# EAGLE schematic TGBD (EAGLE 9.6.2)

## Sheet 1 of 3
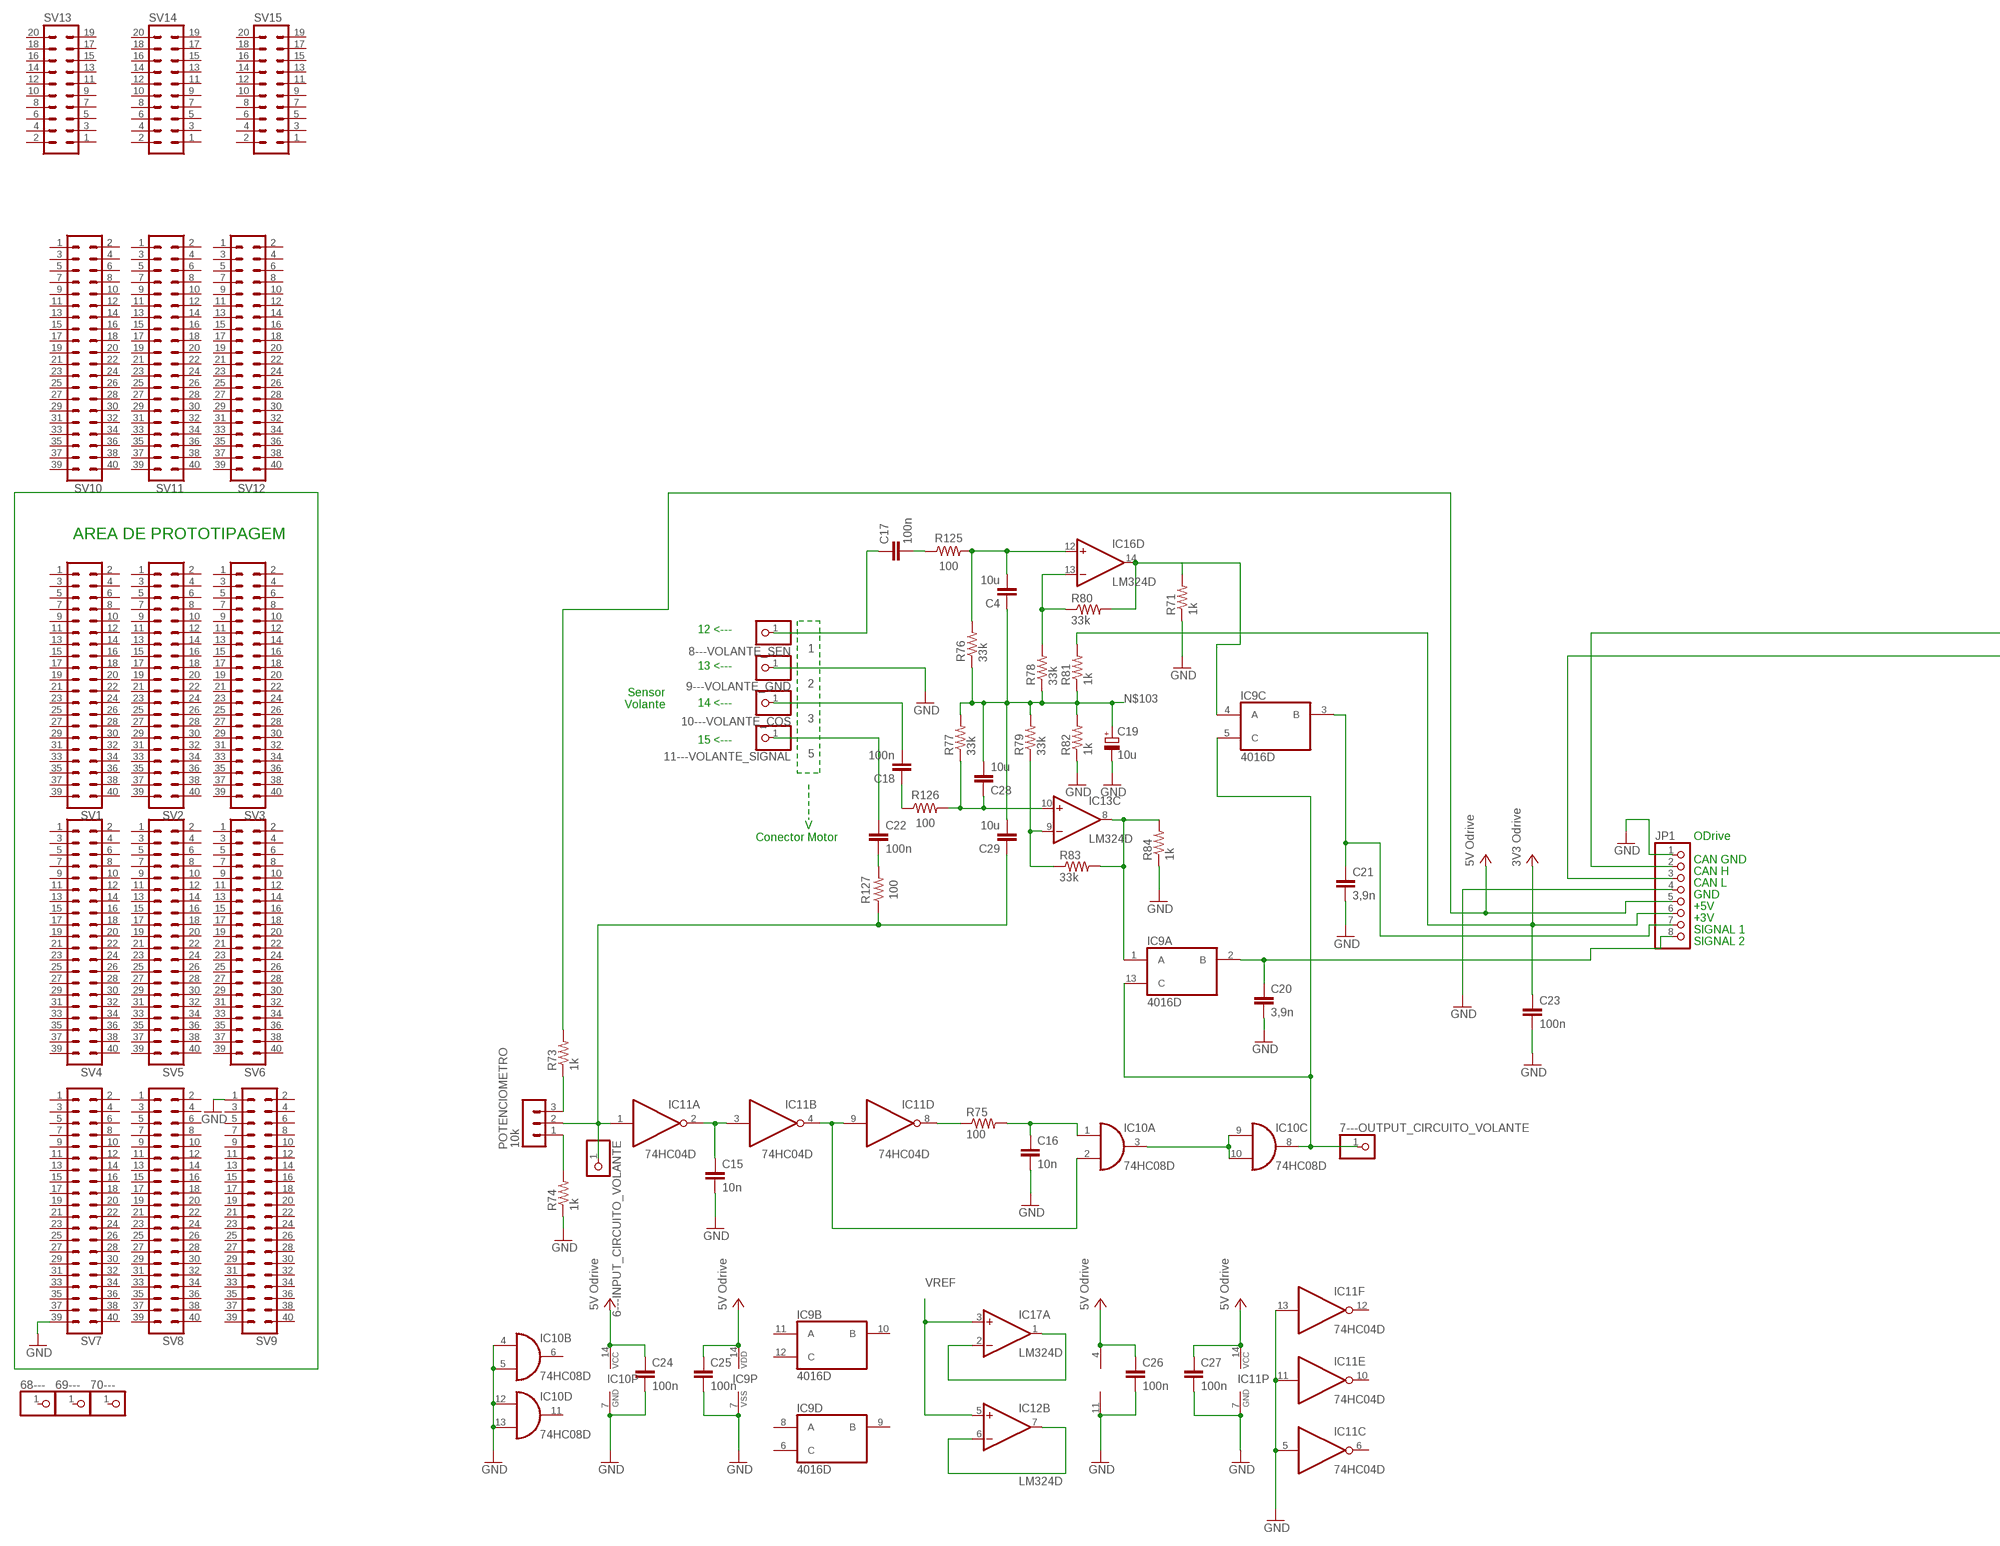
[diagram p0: schematic, sheet 1, part 1 of 2]
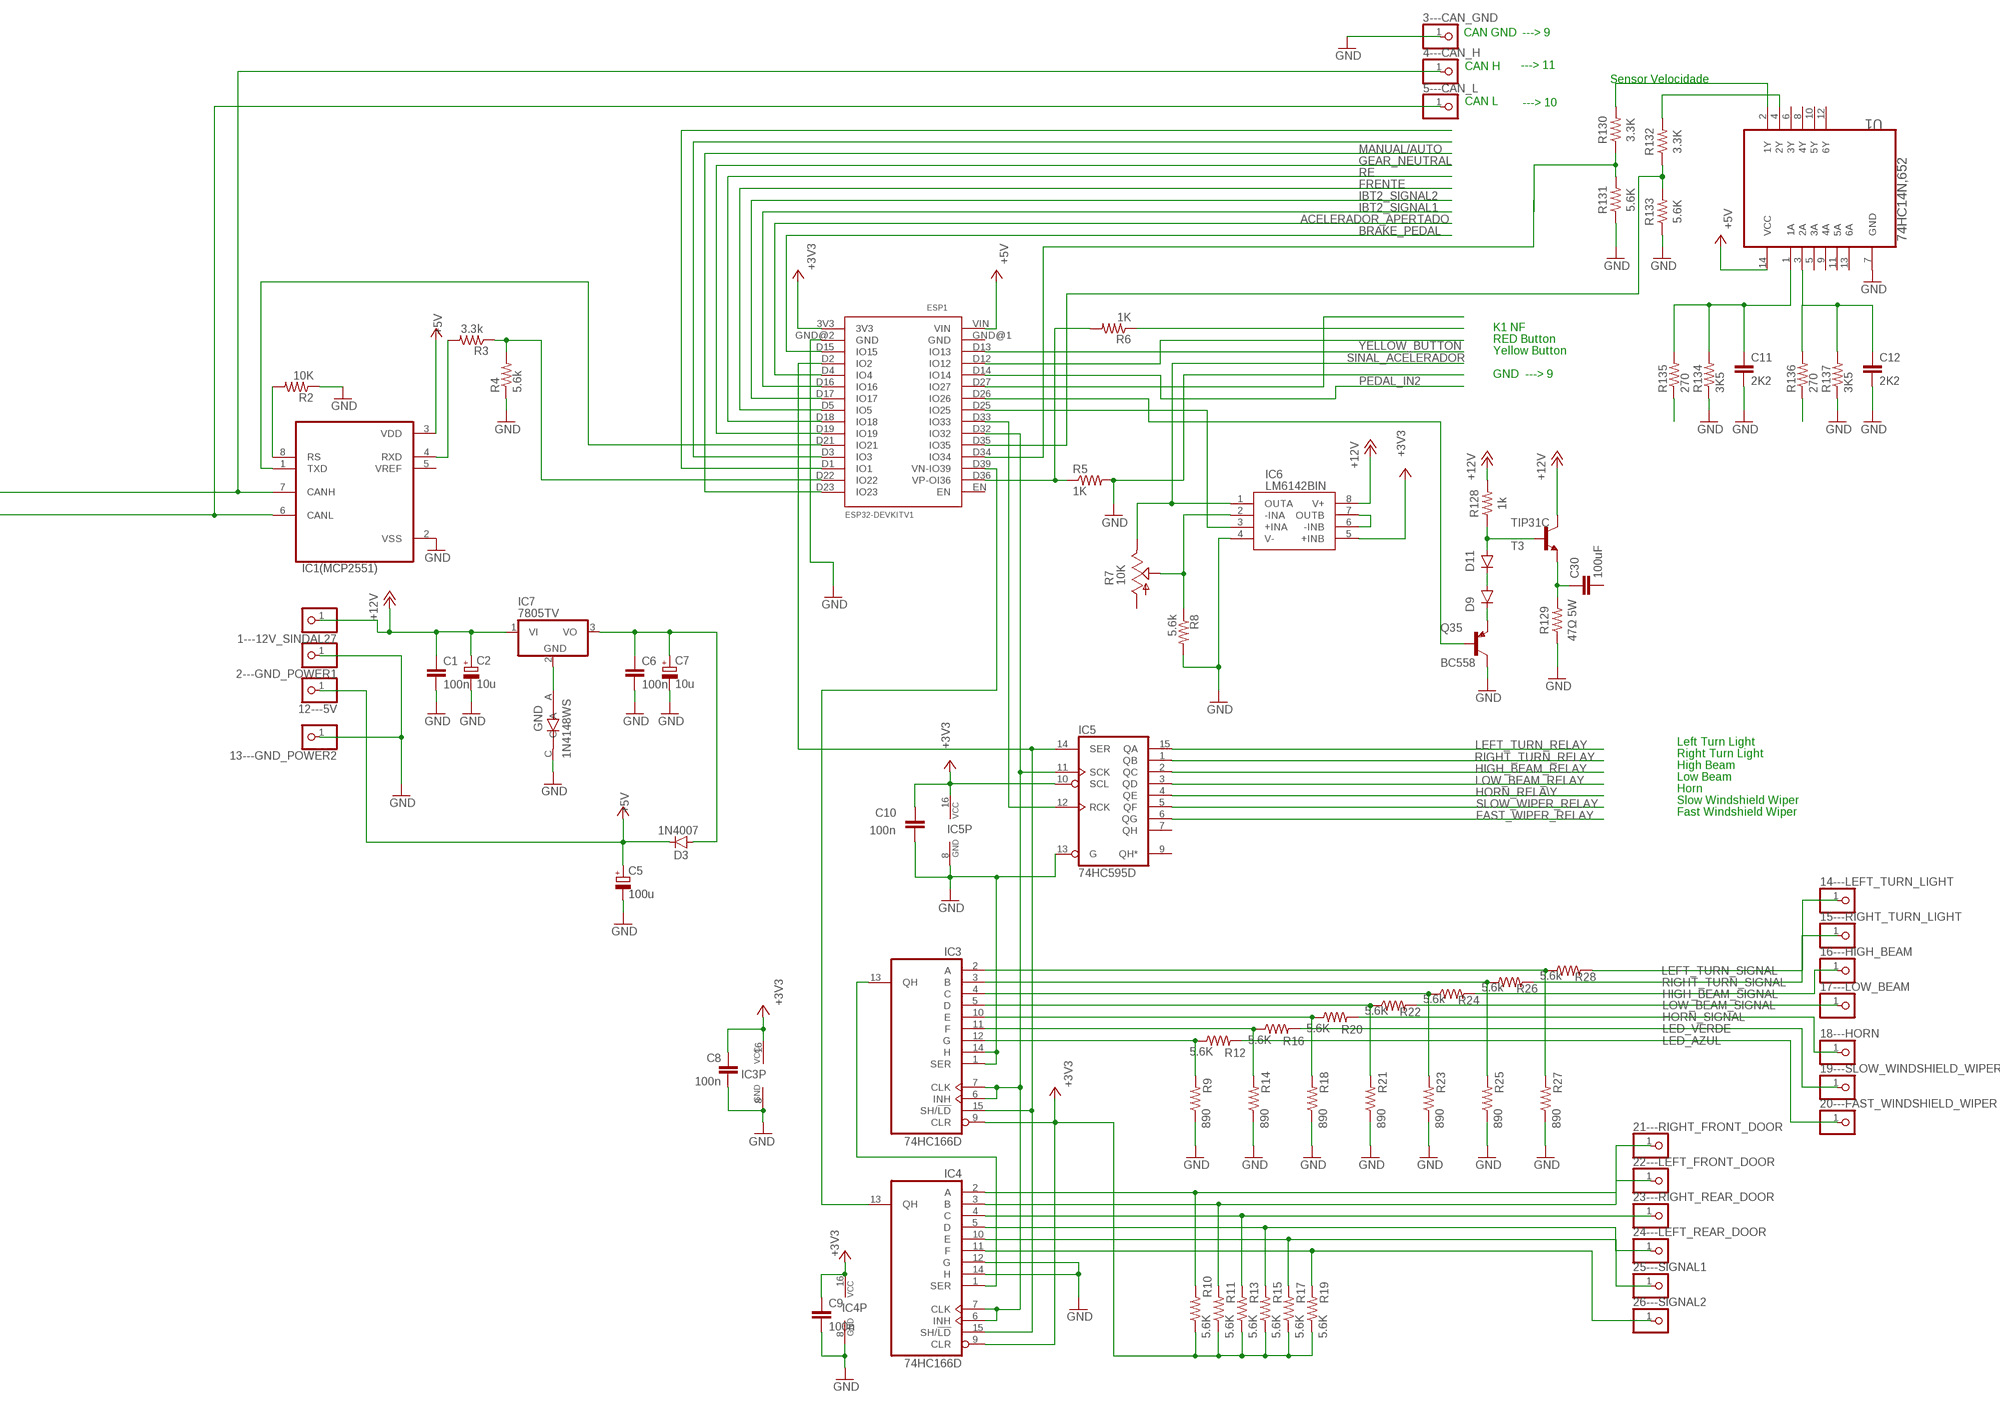
[diagram p1: schematic, sheet 1, part 2 of 2]

### Parts
1---12V_SINDAL27  PINHD-1X1  [1X01]
2---GND_POWER1  PINHD-1X1  [1X01]
3---CAN_GND  PINHD-1X1  [1X01]
4---CAN_H  PINHD-1X1  [1X01]
5---CAN_L  PINHD-1X1  [1X01]
6---INPUT_CIRCUITO_VOLANTE  PINHD-1X1  [1X01]
7---OUTPUT_CIRCUITO_VOLANTE  PINHD-1X1  [1X01]
8---VOLANTE_SEN  1  PINHD-1X1  [1X01]
9---VOLANTE_GND  2  PINHD-1X1  [1X01]
10---VOLANTE_COS  3  PINHD-1X1  [1X01]
11---VOLANTE_SIGNAL  5  PINHD-1X1  [1X01]
12---5V  PINHD-1X1  [1X01]
13---GND_POWER2  PINHD-1X1  [1X01]
14---LEFT_TURN_LIGHT  PINHD-1X1  [1X01]
15---RIGHT_TURN_LIGHT  PINHD-1X1  [1X01]
16---HIGH_BEAM  PINHD-1X1  [1X01]
17---LOW_BEAM  PINHD-1X1  [1X01]
18---HORN  PINHD-1X1  [1X01]
19---SLOW_WINDSHIELD_WIPER  PINHD-1X1  [1X01]
20---FAST_WINDSHIELD_WIPER  PINHD-1X1  [1X01]
21---RIGHT_FRONT_DOOR  PINHD-1X1  [1X01]
22---LEFT_FRONT_DOOR  PINHD-1X1  [1X01]
23---RIGHT_REAR_DOOR  PINHD-1X1  [1X01]
24---LEFT_REAR_DOOR  PINHD-1X1  [1X01]
25---SIGNAL1  PINHD-1X1  [1X01]
26---SIGNAL2  PINHD-1X1  [1X01]
68---  PINHD-1X1  [1X01]
69---  PINHD-1X1  [1X01]
70---  PINHD-1X1  [1X01]
C1  100n  C-EUC0402  [C0402]
C2  10u  CPOL-EUA/3216-18R  [A/3216-18R]
C4  10u  C-EUC0402  [C0402]
C5  100u  CPOL-EUUD-6,3X7,7  [UD-6,3X7,7_NICHICON]
C6  100n  C-EUC0402  [C0402]
C7  10u  CPOL-EUA/3216-18R  [A/3216-18R]
C8  100n  C-EUC0402  [C0402]
C9  100n  C-EUC0402  [C0402]
C10  100n  C-EUC0402  [C0402]
C11  2K2  C2,5-3  [C2.5-3]
C12  2K2  C2,5-3  [C2.5-3]
C15  10n  C-EUC0402  [C0402]
C16  10n  C-EUC0402  [C0402]
C17  100n  C-EUC0402  [C0402]
C18  100n  C-EUC0402  [C0402]
C19  10u  CPOL-EUA/3216-18R  [A/3216-18R]
C20  3,9n  C-EUC0402  [C0402]
C21  3,9n  C-EUC0402  [C0402]
C22  100n  C-EUC0402  [C0402]
C23  100n  C-EUC0402  [C0402]
C24  100n  C-EUC0402  [C0402]
C25  100n  C-EUC0402  [C0402]
C26  100n  C-EUC0402  [C0402]
C27  100n  C-EUC0402  [C0402]
C28  10u  C-EUC0402  [C0402]
C29  10u  C-EUC0402  [C0402]
C30  100uF  C2.5/2  [C2.5-2]
D3  1N4007  DIODE-SOD123  [SOD123]
D9  1N4148DO35-7  [DO35-7]
D11  1N4148DO35-7  [DO35-7]
ESP1  ESP32DEVKITV1  [ESP32-DEVKITV1]
GND  1N4148WS  [SODFL2512X100N]
IC1(MCP2551)  MCP2551-I/SN  [SOIC127P599X175-8N]
IC3  74HC166D  [SO16]
IC4  74HC166D  [SO16]
IC5  74HC595D  [SO16]
IC6  LM6142BIN  [DIP254P762X508-8]
IC7  7805TV  [TO220V]
IC8  LM324D  [SO14]
IC9  4016D  [SO14]
IC10  74HC08D  [SO14]
IC11  74HC04D  [SO14]
IC12  LM324D  [SO14]
IC13  LM324D  [SO14]
IC16  LM324D  [SO14]
IC17  LM324D  [SO14]
JP1  PINHD-1X8  [1X08]
POTENCIOMETRO  10k  MA03-1  [MA03-1]
Q35  BC558  [TO92260P520H933-3]
R2  10K  R-US_R0603  [R0603]
R3  3.3k  R-US_R0402  [R0402]
R4  5.6k  R-US_R0603  [R0603]
R5  1K  R-US_R0402  [R0402]
R6  1K  R-US_R0402  [R0402]
R7  10K  TRIM_US-CT6  [CT6]
R8  5.6k  R-US_R0603  [R0603]
R9  890  R-US_R0603  [R0603]
R10  5.6K  R-US_R0603  [R0603]
R11  5.6K  R-US_R0603  [R0603]
R12  5.6K  R-US_R0603  [R0603]
R13  5.6K  R-US_R0603  [R0603]
R14  890  R-US_R0603  [R0603]
R15  5.6K  R-US_R0603  [R0603]
R16  5.6K  R-US_R0603  [R0603]
R17  5.6K  R-US_R0603  [R0603]
R18  890  R-US_R0603  [R0603]
R19  5.6K  R-US_R0603  [R0603]
R20  5.6K  R-US_R0603  [R0603]
R21  890  R-US_R0603  [R0603]
R22  5.6K  R-US_R0603  [R0603]
R23  890  R-US_R0603  [R0603]
R24  5.6k  R-US_R0603  [R0603]
R25  890  R-US_R0603  [R0603]
R26  5.6k  R-US_R0603  [R0603]
R27  890  R-US_R0603  [R0603]
R28  5.6k  R-US_R0603  [R0603]
R71  1k  R-US_R0402  [R0402]
R73  1k  R-US_R0402  [R0402]
R74  1k  R-US_R0402  [R0402]
R75  100  R-US_R0603  [R0603]
R76  33k  R-US_R0402  [R0402]
R77  33k  R-US_R0402  [R0402]
R78  33k  R-US_R0402  [R0402]
R79  33k  R-US_R0402  [R0402]
R80  33k  R-US_R0402  [R0402]
R81  1k  R-US_R0402  [R0402]
R82  1k  R-US_R0402  [R0402]
R83  33k  R-US_R0402  [R0402]
R84  1k  R-US_R0402  [R0402]
R125  100  R-US_CHIP-0402(1005-METRIC)  [RESC1005X40]
R126  100  R-US_CHIP-0402(1005-METRIC)  [RESC1005X40]
R127  100  R-US_CHIP-0402(1005-METRIC)  [RESC1005X40]
R128  1k  R-US_AXIAL-7.2MM-PITCH  [RESAD724W46L381D178B]
R129  47Ω 5W  R-US_AXIAL-7.2MM-PITCH  [RESAD724W46L381D178B]
R130  3.3K  R-US_AXIAL-7.2MM-PITCH  [RESAD724W46L381D178B]
R131  5.6K  R-US_AXIAL-7.2MM-PITCH  [RESAD724W46L381D178B]
R132  3.3K  R-US_AXIAL-7.2MM-PITCH  [RESAD724W46L381D178B]
R133  5.6K  R-US_AXIAL-7.2MM-PITCH  [RESAD724W46L381D178B]
R134  3K5  R-US_0204/7  [0204/7]
R135  270  R-US_0204/7  [0204/7]
R136  270  R-US_0204/7  [0204/7]
R137  3K5  R-US_0204/7  [0204/7]
SV1  MA20-2  [MA20-2]
SV2  MA20-2  [MA20-2]
SV3  MA20-2  [MA20-2]
SV4  MA20-2  [MA20-2]
SV5  MA20-2  [MA20-2]
SV6  MA20-2  [MA20-2]
SV7  MA20-2  [MA20-2]
SV8  MA20-2  [MA20-2]
SV9  MA20-2  [MA20-2]
SV10  MA20-2  [MA20-2]
SV11  MA20-2  [MA20-2]
SV12  MA20-2  [MA20-2]
SV13  MA10-2  [MA10-2]
SV14  MA10-2  [MA10-2]
SV15  MA10-2  [MA10-2]
T3  TIP31C  [TO220]
U1  74HC14N,652  [DIP254P762X420-14]

### Nets
3V3_ODRIVE [Power]: C23.1 JP1.6 R81.2 ; supply symbol labelled 3V3 Odrive
5V_ODRIVE [Power]: C24.1 C25.1 C26.1 C27.1 IC8.4(P:V+) IC9.14(P:VDD) IC10.14(P:VCC) IC11.14(P:VCC) JP1.5 R73.2 ; supply symbol labelled 5V Odrive
9---GND [Power]: 9---VOLANTE_GND.1 ; supply symbol labelled GND
+3V3 [Power]: C8.1 C9.1 C10.1 ESP1.3V3 IC3.9(CLR) IC3.16(VCC) IC4.9(CLR) IC4.16(VCC) IC5.10(SCL) IC5.16(VCC) IC6.5(+INB) R10.1 R11.1 R13.1 R15.1 R17.1 R19.1
+5V [Power]: 12---5V.1 C5.+ D3.C ESP1.VIN IC1(MCP2551).3(VDD) U1.14(VCC) ; also sheet 2
+12V [Power]: 1---12V_SINDAL27.1 C1.1 C2.+ IC6.8(V+) IC7.1(VI) R128.2 T3.2(C) ; also sheet 2
ACELERADOR_APERTADO: ESP1.D4(IO4) ; also sheet 2
AUTONOMO/NAO: ESP1.D27(IO27)
BRAKE_PEDAL: ESP1.D15(IO15)
FAST_WIPER_RELAY: IC5.6(QG) ; also sheet 2
FRENTE: ESP1.D5(IO5) ; also sheet 2
GEAR_NEUTRAL: ESP1.D19(IO19)
GND [Power]: 2---GND_POWER1.1 3---CAN_GND.1 13---GND_POWER2.1 C1.2 C2.- C5.- C6.2 C7.- C8.2 C9.2 C10.2 C11.2 C12.2 C15.2 C16.2 C19.- C20.2 C21.2 C23.2 C24.2 C25.2 C26.2 C27.2 ESP1.GND@2(GND) GND.C IC1(MCP2551).2(VSS) IC3.1(SER) IC3.8(GND) IC3.14(H) IC4.8(GND) IC4.12(G) IC4.14(H) IC5.8(GND) IC5.13(G) IC6.4(V-) IC8.11(P:V-) IC9.7(P:VSS) IC10.4(B:I0) IC10.5(B:I1) IC10.7(P:GND) IC10.12(D:I0) IC10.13(D:I1) IC11.5(C:I) IC11.7(P:GND) IC11.11(E:I) IC11.13(F:I) JP1.1 JP1.4 Q35.1(C) R2.1 R4.1 R5.2 R8.2 R9.1 R14.1 R18.1 R21.1 R23.1 R25.1 R27.1 R71.1 R74.1 R82.1 R84.1 R129.1 R131.1 R133.1 R134.1 R137.1 SV7.39 SV9.1 U1.7(GND) ; also sheet 2
HIGH_BEAM_RELAY: IC5.2(QC) ; also sheet 2
HIGH_BEAM_SIGNAL: 16---HIGH_BEAM.1 R24.2 ; also sheet 2
HORN_RELA\Y: IC5.4(QE)
HORN_SIGNAL: 18---HORN.1 R20.2 ; also sheet 2
IBT2_SIGNAL1: ESP1.D16(IO16)
IBT2_SIGNAL2: ESP1.D17(IO17)
LED_AZUL: 20---FAST_WINDSHIELD_WIPER.1 R12.2 ; also sheet 2
LED_VERDE: 19---SLOW_WINDSHIELD_WIPER.1 R16.2 ; also sheet 2
LEFT_TURN_RELAY: IC5.15(QA) ; also sheet 2
LEFT_TURN_SIGNAL: 14---LEFT_TURN_LIGHT.1 R28.2 ; also sheet 2
LOW_BEAM_RELAY: IC5.3(QD) ; also sheet 2
LOW_BEAM_SIGNAL: 17---LOW_BEAM.1 R22.2 ; also sheet 2
MANUAL/AUTO: ESP1.D23(IO23) ; also sheet 2
N$1: IC6.6(-INB) IC6.7(OUTB)
N$2: ESP1.D25(IO25) IC6.3(+INA)
N$3: IC6.2(-INA) R7.S R8.1
N$6: ESP1.D21(IO21) IC1(MCP2551).1(TXD)
N$8: IC1(MCP2551).8(RS) R2.2
N$10: IC1(MCP2551).4(RXD) R3.2
N$11: 4---CAN_H.1 IC1(MCP2551).7(CANH) JP1.2
N$12: GND.A IC7.2(GND)
N$14: ESP1.D32(IO32) IC3.6(INH) IC3.7(CLK) IC4.6(INH) IC4.7(CLK) IC5.11(SCK)
N$15: ESP1.D22(IO22) R3.1 R4.2
N$18 [Power]: C6.1 C7.+ D3.A IC7.3(VO)
N$21: POTENCIOMETRO.3 R73.1
N$27: ESP1.D36(VP-OI36) R5.1 R6.2
N$28: D9.C Q35.3(E)
N$29: R6.1
N$30: ESP1.D12(IO12)
N$32: IC3.2(A) R27.2 R28.1
N$40: ESP1.D33(IO33) IC5.12(RCK)
N$42: IC3.3(B) R25.2 R26.1
N$44: IC3.4(C) R23.2 R24.1
N$46: IC3.5(D) R21.2 R22.1
N$47: ESP1.D39(VN-IO39) IC4.13(QH)
N$48: 21---RIGHT_FRONT_DOOR.1 IC4.2(A) R10.2
N$49: 22---LEFT_FRONT_DOOR.1 IC4.3(B) R11.2
N$50: 23---RIGHT_REAR_DOOR.1 IC4.4(C) R13.2
N$51: 24---LEFT_REAR_DOOR.1 IC4.5(D) R15.2
N$52: IC3.13(QH) IC4.1(SER)
N$54: IC3.10(E) R18.2 R20.1
N$56: IC3.11(F) R14.2 R16.1
N$58: IC3.12(G) R9.2 R12.1
N$59: ESP1.D3(IO3)
N$99: C15.1 IC11.2(A:O) IC11.3(B:I)
N$100: IC10.3(A:O) IC10.9(C:I0) IC10.10(C:I1)
N$101: 5---CAN_L.1 IC1(MCP2551).6(CANL) JP1.3
N$102: POTENCIOMETRO.1 R74.2
N$103: C4.1 C19.+ C28.2 C29.2 R76.1 R77.2 R78.1 R79.2 R81.1 R82.2
N$104: IC11.8(D:O) R75.1
N$105: C16.1 IC10.1(A:I0) R75.2
N$106: IC10.2(A:I1) IC11.4(B:O) IC11.9(D:I)
N$107: C4.2 IC16.12(D:+IN) R76.2 R125.2
N$108: 8---VOLANTE_SEN.1 C17.1
N$109: C11.1 R134.2 R135.2 U1.1(1A)
N$110: IC13.9(C:-IN) R79.1 R83.1
N$111: IC16.13(D:-IN) R78.2 R80.1
N$112: 10---VOLANTE_COS.1 C18.2
N$113: IC9.1(A:A) IC13.8(C:OUT) R83.2 R84.2
N$114: C20.1 IC9.2(A:B) JP1.8
N$115: IC17.1(A:OUT) IC17.2(A:-IN)
N$116: IC12.6(B:-IN) IC12.7(B:OUT)
N$117: 7---OUTPUT_CIRCUITO_VOLANTE.1 IC9.5(C:C) IC9.13(A:C) IC10.8(C:O)
N$118: C21.1 IC9.3(C:B) JP1.7
N$119: 11---VOLANTE_SIGNAL.1 C22.1
N$120: C28.1 IC13.10(C:+IN) R77.1 R126.2
N$182: IC9.4(C:A) IC16.14(D:OUT) R71.2 R80.2
N$187: ESP1.D1(IO1)
N$191: 25---SIGNAL1.1 IC4.10(E) R17.2
N$192: 26---SIGNAL2.1 IC4.11(F) R19.2
N$205: R135.1
N$216: C17.2 R125.1
N$218: C18.1 R126.1
N$219: C22.2 R127.2
N$222: ESP1.D2(IO2) IC3.15(SH/!LD) IC4.15(SH/!LD) IC5.14(SER)
N$223: ESP1.D26(IO26) Q35.2(B)
N$224: D9.A D11.C
N$225: D11.A R128.1 T3.1(B)
N$226: R130.1 R131.2
N$227: R130.2 U1.2(1Y)
N$228: C30.1 R129.2 T3.3(E)
N$229: C12.1 R136.2 R137.2 U1.3(2A)
N$230: R132.2 U1.4(2Y)
N$231: R136.1
N$232: ESP1.D35(IO35) R132.1 R133.2
PEDAL_IN1: ESP1.D34(IO34)
PEDAL_IN2: ESP1.D14(IO14)
RE: ESP1.D18(IO18) ; also sheet 2
RIGHT_TURN_RELAY: IC5.1(QB) ; also sheet 2
RIGHT_TURN_SIGNAL: 15---RIGHT_TURN_LIGHT.1 R26.2 ; also sheet 2
SINAL_ACELERADOR: IC6.1(OUTA) R7.E ; also sheet 2
SLOW_WIPER_RELAY: IC5.5(QF) ; also sheet 2
VREF: 6---INPUT_CIRCUITO_VOLANTE.1 C29.1 IC11.1(A:I) IC12.5(B:+IN) IC17.3(A:+IN) POTENCIOMETRO.2 R127.1
YELLOW_BUTTON: ESP1.D13(IO13) ; also sheet 2
Unconnected: 68---.1 69---.1 70---.1 C30.2 ESP1.EN ESP1.GND@1(GND) IC1(MCP2551).5(VREF) IC5.7(QH) IC5.9(QH*) IC8.1(A:OUT) IC8.2(A:-IN) IC8.3(A:+IN) IC8.5(B:+IN) IC8.6(B:-IN) IC8.7(B:OUT) IC8.8(C:OUT) IC8.9(C:-IN) IC8.10(C:+IN) IC8.12(D:+IN) IC8.13(D:-IN) IC8.14(D:OUT) IC9.6(D:C) IC9.8(D:A) IC9.9(D:B) IC9.10(B:B) IC9.11(B:A) IC9.12(B:C) IC10.6(B:O) IC10.11(D:O) IC11.6(C:O) IC11.10(E:O) IC11.12(F:O) IC12.1(A:OUT) IC12.2(A:-IN) IC12.3(A:+IN) IC12.8(C:OUT) IC12.9(C:-IN) IC12.10(C:+IN) IC12.12(D:+IN) IC12.13(D:-IN) IC12.14(D:OUT) IC13.1(A:OUT) IC13.2(A:-IN) IC13.3(A:+IN) IC13.5(B:+IN) IC13.6(B:-IN) IC13.7(B:OUT) IC13.12(D:+IN) IC13.13(D:-IN) IC13.14(D:OUT) IC16.1(A:OUT) IC16.2(A:-IN) IC16.3(A:+IN) IC16.5(B:+IN) IC16.6(B:-IN) IC16.7(B:OUT) IC16.8(C:OUT) IC16.9(C:-IN) IC16.10(C:+IN) IC17.5(B:+IN) IC17.6(B:-IN) IC17.7(B:OUT) IC17.8(C:OUT) IC17.9(C:-IN) IC17.10(C:+IN) IC17.12(D:+IN) IC17.13(D:-IN) IC17.14(D:OUT) R7.A SV1.1 SV1.2 SV1.3 SV1.4 SV1.5 SV1.6 SV1.7 SV1.8 SV1.9 SV1.10 SV1.11 SV1.12 SV1.13 SV1.14 SV1.15 SV1.16 SV1.17 SV1.18 SV1.19 SV1.20 SV1.21 SV1.22 SV1.23 SV1.24 SV1.25 SV1.26 SV1.27 SV1.28 SV1.29 SV1.30 SV1.31 SV1.32 SV1.33 SV1.34 SV1.35 SV1.36 SV1.37 SV1.38 SV1.39 SV1.40 SV2.1 SV2.2 SV2.3 SV2.4 SV2.5 SV2.6 SV2.7 SV2.8 SV2.9 SV2.10 SV2.11 SV2.12 SV2.13 SV2.14 SV2.15 SV2.16 SV2.17 SV2.18 SV2.19 SV2.20 SV2.21 SV2.22 SV2.23 SV2.24 SV2.25 SV2.26 SV2.27 SV2.28 SV2.29 SV2.30 SV2.31 SV2.32 SV2.33 SV2.34 SV2.35 SV2.36 SV2.37 SV2.38 SV2.39 SV2.40 SV3.1 SV3.2 SV3.3 SV3.4 SV3.5 SV3.6 SV3.7 SV3.8 SV3.9 SV3.10 SV3.11 SV3.12 SV3.13 SV3.14 SV3.15 SV3.16 SV3.17 SV3.18 SV3.19 SV3.20 SV3.21 SV3.22 SV3.23 SV3.24 SV3.25 SV3.26 SV3.27 SV3.28 SV3.29 SV3.30 SV3.31 SV3.32 SV3.33 SV3.34 SV3.35 SV3.36 SV3.37 SV3.38 SV3.39 SV3.40 SV4.1 SV4.2 SV4.3 SV4.4 SV4.5 SV4.6 SV4.7 SV4.8 SV4.9 SV4.10 SV4.11 SV4.12 SV4.13 SV4.14 SV4.15 SV4.16 SV4.17 SV4.18 SV4.19 SV4.20 SV4.21 SV4.22 SV4.23 SV4.24 SV4.25 SV4.26 SV4.27 SV4.28 SV4.29 SV4.30 SV4.31 SV4.32 SV4.33 SV4.34 SV4.35 SV4.36 SV4.37 SV4.38 SV4.39 SV4.40 SV5.1 SV5.2 SV5.3 SV5.4 SV5.5 SV5.6 SV5.7 SV5.8 SV5.9 SV5.10 SV5.11 SV5.12 SV5.13 SV5.14 SV5.15 SV5.16 SV5.17 SV5.18 SV5.19 SV5.20 SV5.21 SV5.22 SV5.23 SV5.24 SV5.25 SV5.26 SV5.27 SV5.28 SV5.29 SV5.30 SV5.31 SV5.32 SV5.33 SV5.34 SV5.35 SV5.36 SV5.37 SV5.38 SV5.39 SV5.40 SV6.1 SV6.2 SV6.3 SV6.4 SV6.5 SV6.6 SV6.7 SV6.8 SV6.9 SV6.10 SV6.11 SV6.12 SV6.13 SV6.14 SV6.15 SV6.16 SV6.17 SV6.18 SV6.19 SV6.20 SV6.21 SV6.22 SV6.23 SV6.24 SV6.25 SV6.26 SV6.27 SV6.28 SV6.29 SV6.30 SV6.31 SV6.32 SV6.33 SV6.34 SV6.35 SV6.36 SV6.37 SV6.38 SV6.39 SV6.40 SV7.1 SV7.2 SV7.3 SV7.4 SV7.5 SV7.6 SV7.7 SV7.8 SV7.9 SV7.10 SV7.11 SV7.12 SV7.13 SV7.14 SV7.15 SV7.16 SV7.17 SV7.18 SV7.19 SV7.20 SV7.21 SV7.22 SV7.23 SV7.24 SV7.25 SV7.26 SV7.27 SV7.28 SV7.29 SV7.30 SV7.31 SV7.32 SV7.33 SV7.34 SV7.35 SV7.36 SV7.37 SV7.38 SV7.40 SV8.1 SV8.2 SV8.3 SV8.4 SV8.5 SV8.6 SV8.7 SV8.8 SV8.9 SV8.10 SV8.11 SV8.12 SV8.13 SV8.14 SV8.15 SV8.16 SV8.17 SV8.18 SV8.19 SV8.20 SV8.21 SV8.22 SV8.23 SV8.24 SV8.25 SV8.26 SV8.27 SV8.28 SV8.29 SV8.30 SV8.31 SV8.32 SV8.33 SV8.34 SV8.35 SV8.36 SV8.37 SV8.38 SV8.39 SV8.40 SV9.2 SV9.3 SV9.4 SV9.5 SV9.6 SV9.7 SV9.8 SV9.9 SV9.10 SV9.11 SV9.12 SV9.13 SV9.14 SV9.15 SV9.16 SV9.17 SV9.18 SV9.19 SV9.20 SV9.21 SV9.22 SV9.23 SV9.24 SV9.25 SV9.26 SV9.27 SV9.28 SV9.29 SV9.30 SV9.31 SV9.32 SV9.33 SV9.34 SV9.35 SV9.36 SV9.37 SV9.38 SV9.39 SV9.40 SV10.1 SV10.2 SV10.3 SV10.4 SV10.5 SV10.6 SV10.7 SV10.8 SV10.9 SV10.10 SV10.11 SV10.12 SV10.13 SV10.14 SV10.15 SV10.16 SV10.17 SV10.18 SV10.19 SV10.20 SV10.21 SV10.22 SV10.23 SV10.24 SV10.25 SV10.26 SV10.27 SV10.28 SV10.29 SV10.30 SV10.31 SV10.32 SV10.33 SV10.34 SV10.35 SV10.36 SV10.37 SV10.38 SV10.39 SV10.40 SV11.1 SV11.2 SV11.3 SV11.4 SV11.5 SV11.6 SV11.7 SV11.8 SV11.9 SV11.10 SV11.11 SV11.12 SV11.13 SV11.14 SV11.15 SV11.16 SV11.17 SV11.18 SV11.19 SV11.20 SV11.21 SV11.22 SV11.23 SV11.24 SV11.25 SV11.26 SV11.27 SV11.28 SV11.29 SV11.30 SV11.31 SV11.32 SV11.33 SV11.34 SV11.35 SV11.36 SV11.37 SV11.38 SV11.39 SV11.40 SV12.1 SV12.2 SV12.3 SV12.4 SV12.5 SV12.6 SV12.7 SV12.8 SV12.9 SV12.10 SV12.11 SV12.12 SV12.13 SV12.14 SV12.15 SV12.16 SV12.17 SV12.18 SV12.19 SV12.20 SV12.21 SV12.22 SV12.23 SV12.24 SV12.25 SV12.26 SV12.27 SV12.28 SV12.29 SV12.30 SV12.31 SV12.32 SV12.33 SV12.34 SV12.35 SV12.36 SV12.37 SV12.38 SV12.39 SV12.40 SV13.1 SV13.2 SV13.3 SV13.4 SV13.5 SV13.6 SV13.7 SV13.8 SV13.9 SV13.10 SV13.11 SV13.12 SV13.13 SV13.14 SV13.15 SV13.16 SV13.17 SV13.18 SV13.19 SV13.20 SV14.1 SV14.2 SV14.3 SV14.4 SV14.5 SV14.6 SV14.7 SV14.8 SV14.9 SV14.10 SV14.11 SV14.12 SV14.13 SV14.14 SV14.15 SV14.16 SV14.17 SV14.18 SV14.19 SV14.20 SV15.1 SV15.2 SV15.3 SV15.4 SV15.5 SV15.6 SV15.7 SV15.8 SV15.9 SV15.10 SV15.11 SV15.12 SV15.13 SV15.14 SV15.15 SV15.16 SV15.17 SV15.18 SV15.19 SV15.20 U1.5(3A) U1.6(3Y) U1.8(4Y) U1.9(4A) U1.10(5Y) U1.11(5A) U1.12(6Y) U1.13(6A)

### Notes on the sheet
- CAN GND | ---> 9
- CAN H
- Sensor Velocidade
- ---> 11
- CAN L | ---> 10
- K1 NF
- RED Button
- Yellow Button
- GND | ---> 9
- AREA DE PROTOTIPAGEM
- Sensor
  Volante
- 12 <---
  
  
  13 <---
  
  
  14 <---
  
  
  15 <---
- V
  Conector Motor
- ODrive
- CAN GND
- CAN H
- CAN L | Left Turn Light
- GND | Right Turn Light
- +5V | High Beam
- +3V | Low Beam
- SIGNAL 1 | Horn
- SIGNAL 2 | Slow Windshield Wiper
- Fast Windshield Wiper

## Sheet 2 of 3
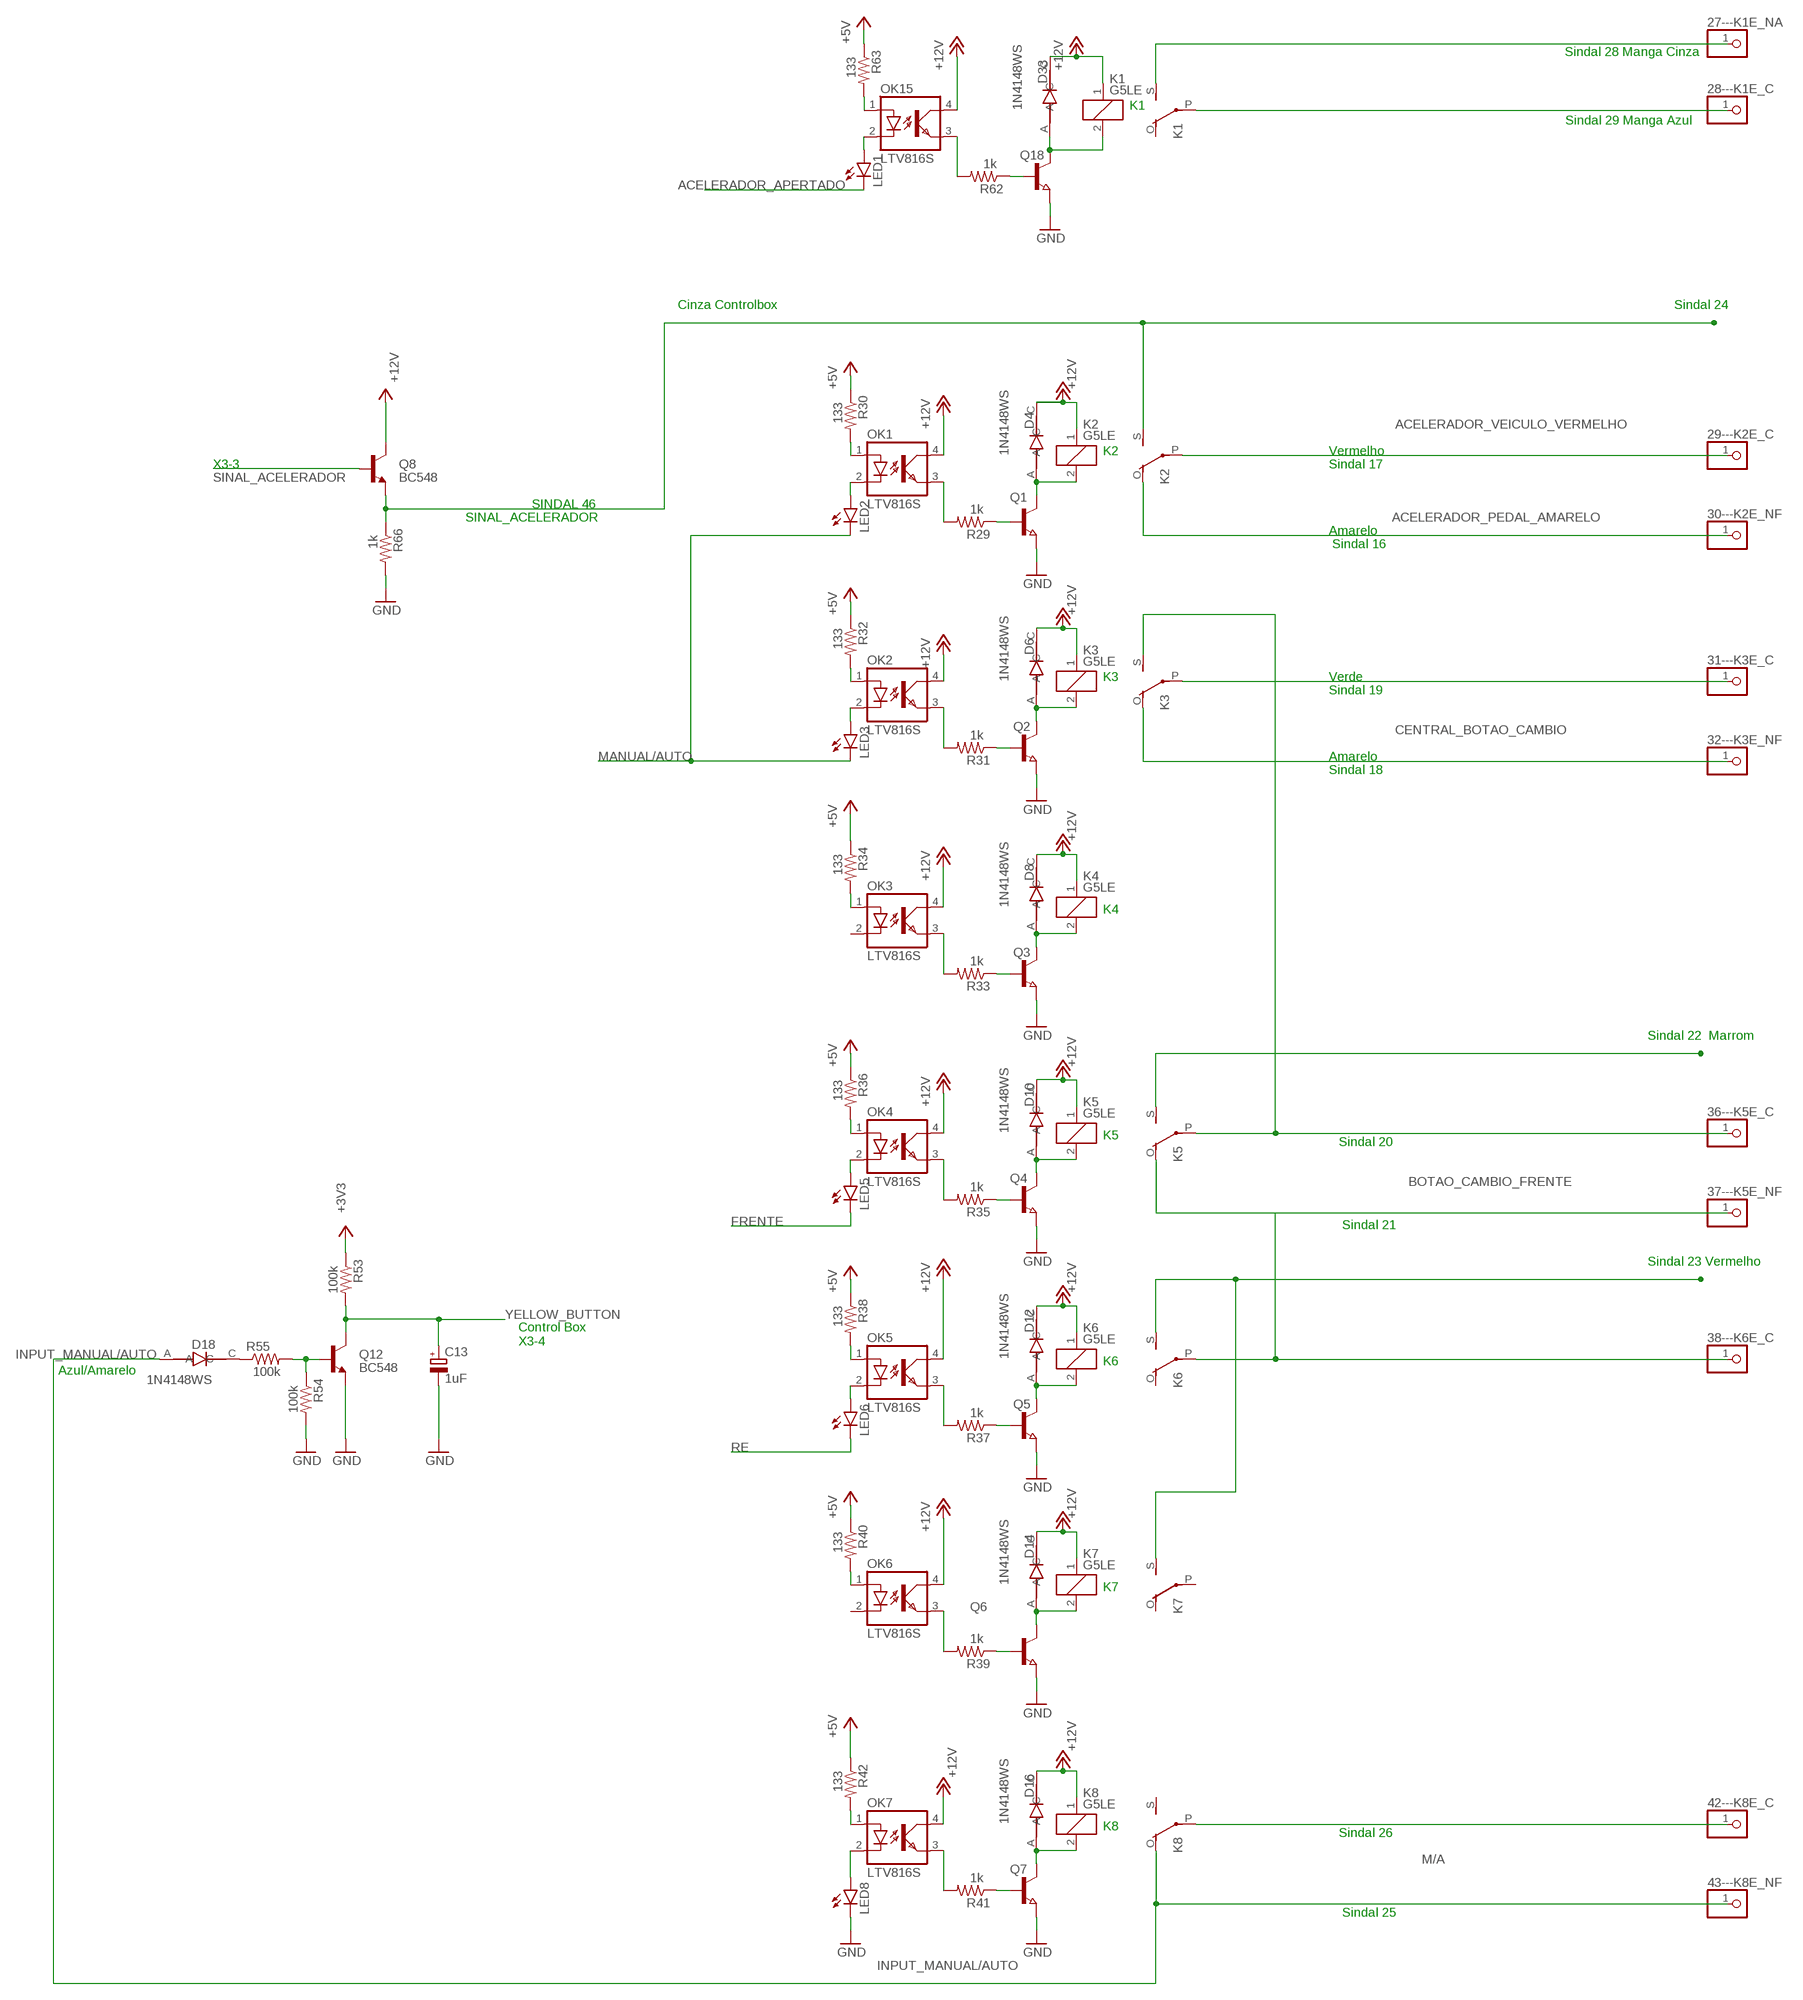
[diagram p2: schematic, sheet 2, part 1 of 2]
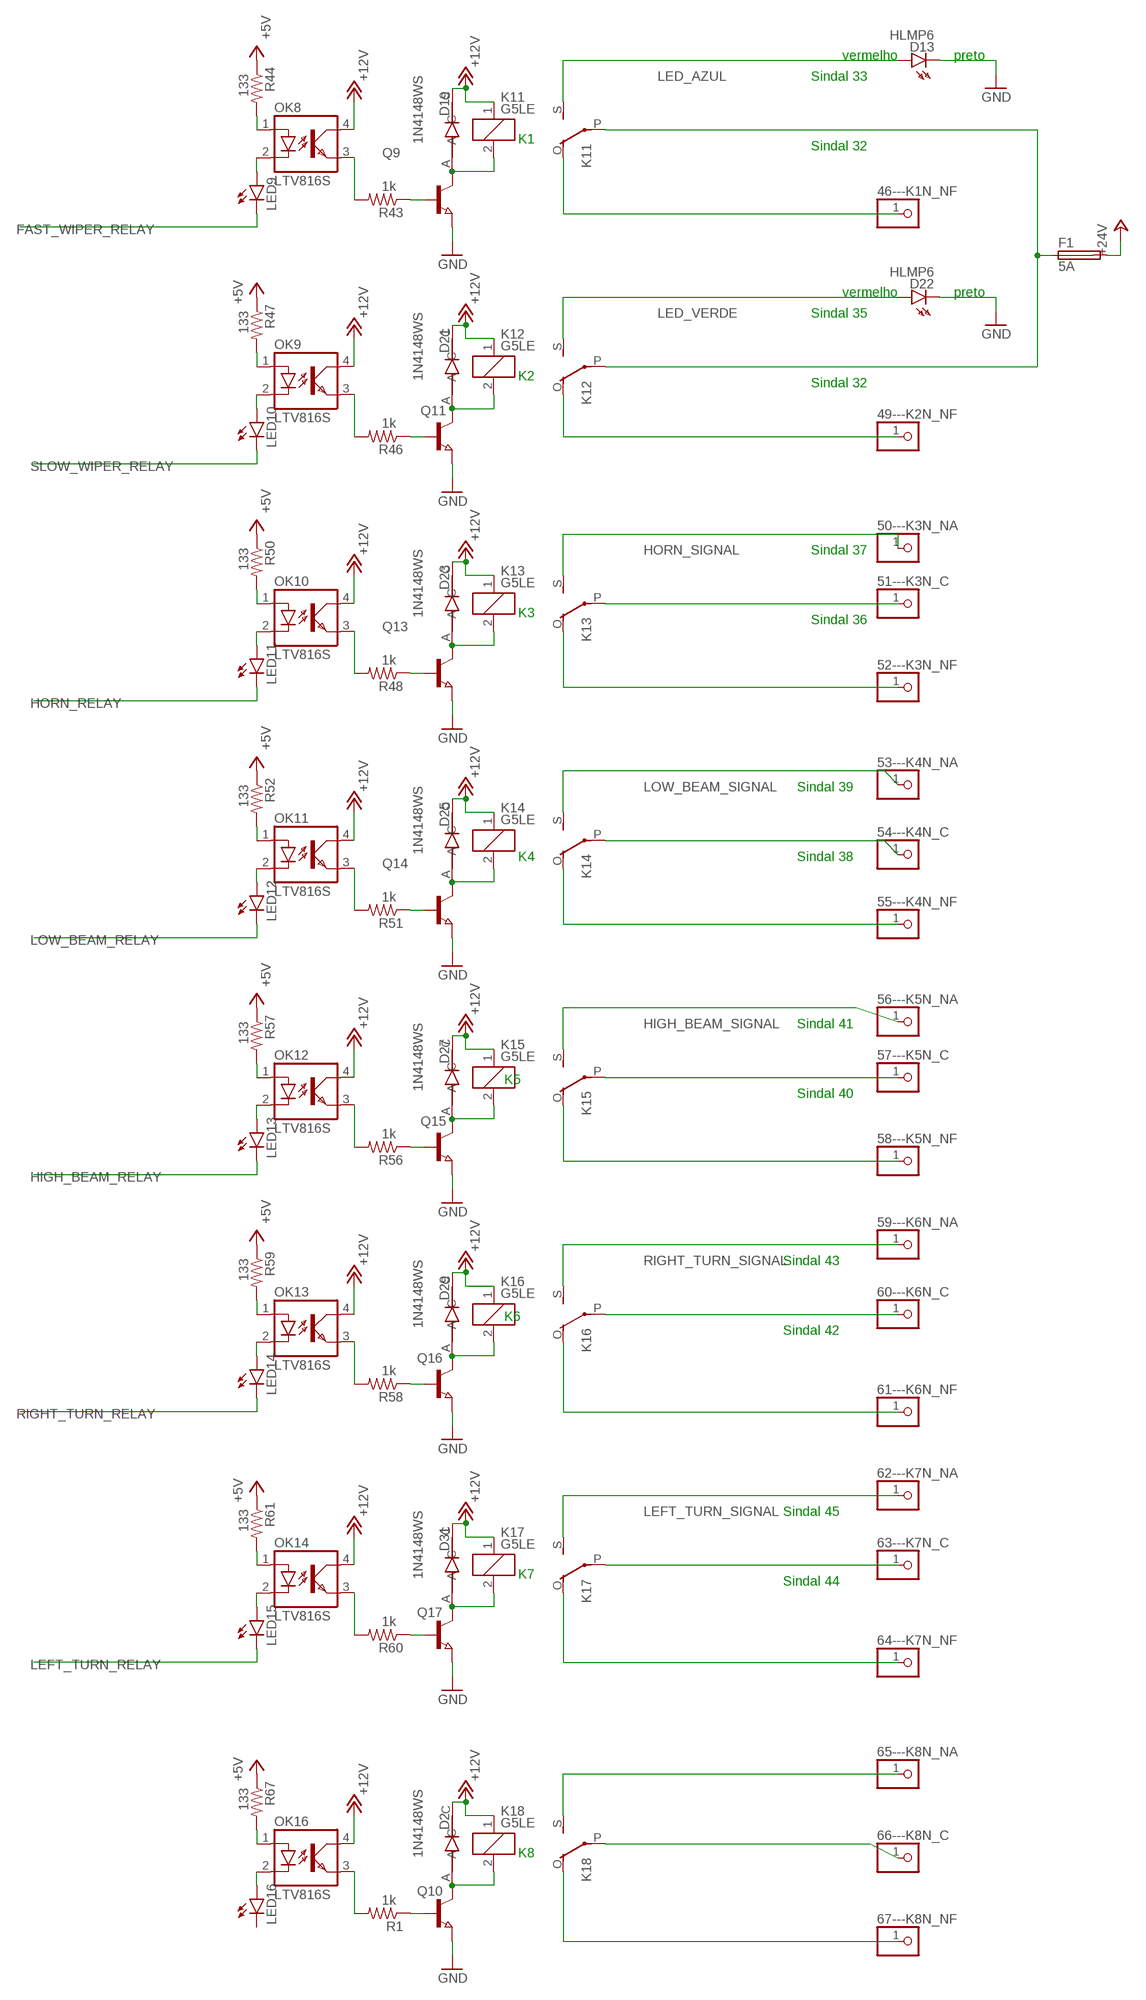
[diagram p3: schematic, sheet 2, part 2 of 2]

### Parts
27---K1E_NA  PINHD-1X1  [1X01]
28---K1E_C  PINHD-1X1  [1X01]
29---K2E_C  PINHD-1X1  [1X01]
30---K2E_NF  PINHD-1X1  [1X01]
31---K3E_C  PINHD-1X1  [1X01]
32---K3E_NF  PINHD-1X1  [1X01]
36---K5E_C  PINHD-1X1  [1X01]
37---K5E_NF  PINHD-1X1  [1X01]
38---K6E_C  PINHD-1X1  [1X01]
42---K8E_C  PINHD-1X1  [1X01]
43---K8E_NF  PINHD-1X1  [1X01]
46---K1N_NF  PINHD-1X1  [1X01]
49---K2N_NF  PINHD-1X1  [1X01]
50---K3N_NA  PINHD-1X1  [1X01]
51---K3N_C  PINHD-1X1  [1X01]
52---K3N_NF  PINHD-1X1  [1X01]
53---K4N_NA  PINHD-1X1  [1X01]
54---K4N_C  PINHD-1X1  [1X01]
55---K4N_NF  PINHD-1X1  [1X01]
56---K5N_NA  PINHD-1X1  [1X01]
57---K5N_C  PINHD-1X1  [1X01]
58---K5N_NF  PINHD-1X1  [1X01]
59---K6N_NA  PINHD-1X1  [1X01]
60---K6N_C  PINHD-1X1  [1X01]
61---K6N_NF  PINHD-1X1  [1X01]
62---K7N_NA  PINHD-1X1  [1X01]
63---K7N_C  PINHD-1X1  [1X01]
64---K7N_NF  PINHD-1X1  [1X01]
65---K8N_NA  PINHD-1X1  [1X01]
66---K8N_C  PINHD-1X1  [1X01]
67---K8N_NF  PINHD-1X1  [1X01]
C13  1uF  CPOL-EUA/3216-18R  [A/3216-18R]
D2  1N4148WS  [SODFL2512X100N]
D4  1N4148WS  [SODFL2512X100N]
D6  1N4148WS  [SODFL2512X100N]
D8  1N4148WS  [SODFL2512X100N]
D10  1N4148WS  [SODFL2512X100N]
D12  1N4148WS  [SODFL2512X100N]
D13  HLMP6  [HLMP6]
D14  1N4148WS  [SODFL2512X100N]
D16  1N4148WS  [SODFL2512X100N]
D18  1N4148WS  [SODFL2512X100N]
D19  1N4148WS  [SODFL2512X100N]
D21  1N4148WS  [SODFL2512X100N]
D22  HLMP6  [HLMP6]
D23  1N4148WS  [SODFL2512X100N]
D25  1N4148WS  [SODFL2512X100N]
D27  1N4148WS  [SODFL2512X100N]
D29  1N4148WS  [SODFL2512X100N]
D31  1N4148WS  [SODFL2512X100N]
D33  1N4148WS  [SODFL2512X100N]
F1  5A  GSH15  [GSH15]
K1  G5LE  [G5LE]
K2  G5LE  [G5LE]
K3  G5LE  [G5LE]
K4  G5LE  [G5LE]
K5  G5LE  [G5LE]
K6  G5LE  [G5LE]
K7  G5LE  [G5LE]
K8  G5LE  [G5LE]
K11  G5LE  [G5LE]
K12  G5LE  [G5LE]
K13  G5LE  [G5LE]
K14  G5LE  [G5LE]
K15  G5LE  [G5LE]
K16  G5LE  [G5LE]
K17  G5LE  [G5LE]
K18  G5LE  [G5LE]
LED1  LEDCHIPLED_0603  [CHIPLED_0603]
LED2  LEDCHIPLED_0603  [CHIPLED_0603]
LED3  LEDCHIPLED_0603  [CHIPLED_0603]
LED5  LEDCHIPLED_0603  [CHIPLED_0603]
LED6  LEDCHIPLED_0603  [CHIPLED_0603]
LED8  LEDCHIPLED_0603  [CHIPLED_0603]
LED9  LEDCHIPLED_0603  [CHIPLED_0603]
LED10  LEDCHIPLED_0603  [CHIPLED_0603]
LED11  LEDCHIPLED_0603  [CHIPLED_0603]
LED12  LEDCHIPLED_0603  [CHIPLED_0603]
LED13  LEDCHIPLED_0603  [CHIPLED_0603]
LED14  LEDCHIPLED_0603  [CHIPLED_0603]
LED15  LEDCHIPLED_0603  [CHIPLED_0603]
LED16  LEDCHIPLED_0603  [CHIPLED_0603]
OK1  LTV816S  [DIL4-SMD]
OK2  LTV816S  [DIL4-SMD]
OK3  LTV816S  [DIL4-SMD]
OK4  LTV816S  [DIL4-SMD]
OK5  LTV816S  [DIL4-SMD]
OK6  LTV816S  [DIL4-SMD]
OK7  LTV816S  [DIL4-SMD]
OK8  LTV816S  [DIL4-SMD]
OK9  LTV816S  [DIL4-SMD]
OK10  LTV816S  [DIL4-SMD]
OK11  LTV816S  [DIL4-SMD]
OK12  LTV816S  [DIL4-SMD]
OK13  LTV816S  [DIL4-SMD]
OK14  LTV816S  [DIL4-SMD]
OK15  LTV816S  [DIL4-SMD]
OK16  LTV816S  [DIL4-SMD]
Q1  NPN-TRANSISTOR_SOT23  [SOT23]
Q2  NPN-TRANSISTOR_SOT23  [SOT23]
Q3  NPN-TRANSISTOR_SOT23  [SOT23]
Q4  NPN-TRANSISTOR_SOT23  [SOT23]
Q5  NPN-TRANSISTOR_SOT23  [SOT23]
Q6  NPN-TRANSISTOR_SOT23  [SOT23]
Q7  NPN-TRANSISTOR_SOT23  [SOT23]
Q8  BC548  S9013  [TO92]
Q9  NPN-TRANSISTOR_SOT23  [SOT23]
Q10  NPN-TRANSISTOR_SOT23  [SOT23]
Q11  NPN-TRANSISTOR_SOT23  [SOT23]
Q12  BC548  S9013  [TO92]
Q13  NPN-TRANSISTOR_SOT23  [SOT23]
Q14  NPN-TRANSISTOR_SOT23  [SOT23]
Q15  NPN-TRANSISTOR_SOT23  [SOT23]
Q16  NPN-TRANSISTOR_SOT23  [SOT23]
Q17  NPN-TRANSISTOR_SOT23  [SOT23]
Q18  NPN-TRANSISTOR_SOT23  [SOT23]
R1  1k  R-US_R0402  [R0402]
R29  1k  R-US_R0402  [R0402]
R30  133  R-US_R0603  [R0603]
R31  1k  R-US_R0402  [R0402]
R32  133  R-US_R0603  [R0603]
R33  1k  R-US_R0402  [R0402]
R34  133  R-US_R0603  [R0603]
R35  1k  R-US_R0402  [R0402]
R36  133  R-US_R0603  [R0603]
R37  1k  R-US_R0402  [R0402]
R38  133  R-US_R0603  [R0603]
R39  1k  R-US_R0402  [R0402]
R40  133  R-US_R0603  [R0603]
R41  1k  R-US_R0402  [R0402]
R42  133  R-US_R0603  [R0603]
R43  1k  R-US_R0402  [R0402]
R44  133  R-US_R0603  [R0603]
R46  1k  R-US_R0402  [R0402]
R47  133  R-US_R0603  [R0603]
R48  1k  R-US_R0402  [R0402]
R50  133  R-US_R0603  [R0603]
R51  1k  R-US_R0402  [R0402]
R52  133  R-US_R0603  [R0603]
R53  100k  R-US_R0402  [R0402]
R54  100k  R-US_R0402  [R0402]
R55  100k  R-US_R0402  [R0402]
R56  1k  R-US_R0402  [R0402]
R57  133  R-US_R0603  [R0603]
R58  1k  R-US_R0402  [R0402]
R59  133  R-US_R0603  [R0603]
R60  1k  R-US_R0402  [R0402]
R61  133  R-US_R0603  [R0603]
R62  1k  R-US_R0402  [R0402]
R63  133  R-US_R0603  [R0603]
R66  1k  R-US_R0402  [R0402]
R67  133  R-US_R0603  [R0603]

### Nets
+3V3_ODRIVE [Power]: R53.1 ; supply symbol labelled +3V3
+5V [Power]: D2.C D16.C D19.C D21.C D23.C D25.C D27.C D29.C D31.C K8.1 K11.1 K12.1 K13.1 K14.1 K15.1 K16.1 K17.1 K18.1 OK7.4(COL) OK8.4(COL) OK9.4(COL) OK10.4(COL) OK11.4(COL) OK12.4(COL) OK13.4(COL) OK14.4(COL) OK16.4(COL) Q8.1(C) R30.1 R32.1 R34.1 R36.1 R38.1 R40.1 R42.1 R44.1 R47.1 R50.1 R52.1 R57.1 R59.1 R61.1 R63.1 R67.1 ; supply symbol labelled +12V ; also sheet 1
+12V [Power]: D4.C D6.C D8.C D10.C D12.C D14.C D33.C K1.1 K2.1 K3.1 K4.1 K5.1 K6.1 K7.1 OK1.4(COL) OK2.4(COL) OK3.4(COL) OK4.4(COL) OK5.4(COL) OK6.4(COL) OK15.4(COL) ; also sheet 1
+24V [Power]: F1.2
ACELERADOR_APERTADO: LED1.C ; also sheet 1
ACELERADOR_PEDAL_AMARELO: 30---K2E_NF.1 K2.O(2:O)
ACELERADOR_VEICULO_VERMELHO: 29---K2E_C.1 K2.P(2:P)
BOTAO_CAMBIO_FRENTE: 37---K5E_NF.1 38---K6E_C.1 K5.O(2:O) K6.P(2:P)
CENTRAL_BOTAO_CAMBIO: 32---K3E_NF.1 K3.O(2:O)
COMUM_CAMBIO: 31---K3E_C.1 K3.P(2:P) K5.S(2:S)
FAST_WIPER_RELAY: LED9.C ; also sheet 1
FRENTE: LED5.C ; also sheet 1
GND [Power]: C13.- D13.K D22.K LED8.C Q1.2(E) Q2.2(E) Q3.2(E) Q4.2(E) Q5.2(E) Q6.2(E) Q7.2(E) Q9.2(E) Q10.2(E) Q11.2(E) Q12.3(E) Q13.2(E) Q14.2(E) Q15.2(E) Q16.2(E) Q17.2(E) Q18.2(E) R54.2 R66.2 ; also sheet 1
HIGH_BEAM_RELAY: LED13.C ; also sheet 1
HIGH_BEAM_SIGNAL: 56---K5N_NA.1 K15.S(2:S) ; also sheet 1
HORN_RELAY: LED11.C
HORN_SIGNAL: 50---K3N_NA.1 K13.S(2:S) ; also sheet 1
INPUT_MANUAL/AUTO: 43---K8E_NF.1 D18.A K8.O(2:O)
LED_AZUL: D13.A K11.S(2:S) ; also sheet 1
LED_VERDE: D22.A K12.S(2:S) ; also sheet 1
LEFT_TURN_RELAY: LED15.C ; also sheet 1
LEFT_TURN_SIGNAL: 62---K7N_NA.1 K17.S(2:S) ; also sheet 1
LOW_BEAM_RELAY: LED12.C ; also sheet 1
LOW_BEAM_SIGNAL: 53---K4N_NA.1 K14.S(2:S) ; also sheet 1
M/A: 42---K8E_C.1 K8.P(2:P)
MANUAL/AUTO: LED2.C LED3.C ; also sheet 1
N$4: K3.S(2:S)
N$5: 36---K5E_C.1 K5.P(2:P)
N$7: K2.S(2:S) Q8.3(E) R66.1
N$9: OK8.1(A) R44.2
N$17 [Power]: D4.A K2.2 Q1.3(C)
N$19: D18.C R55.1
N$20: 65---K8N_NA.1 K18.S(2:S)
N$22: K6.S(2:S) K7.S(2:S)
N$23: LED9.A OK8.2(C)
N$24: OK8.3(EMIT) R43.2
N$25: Q9.1(B) R43.1
N$26 [Power]: D16.A K8.2 Q7.3(C)
N$31: OK15.1(A) R63.2
N$33: F1.1 K11.P(2:P) K12.P(2:P)
N$34: LED1.A OK15.2(C)
N$36: OK15.3(EMIT) R62.2
N$37: 51---K3N_C.1 K13.P(2:P)
N$38: Q18.1(B) R62.1
N$39: 54---K4N_C.1 K14.P(2:P)
N$41 [Power]: D33.A K1.2 Q18.3(C)
N$43: 57---K5N_C.1 K15.P(2:P)
N$45: 27---K1E_NA.1 K1.S(2:S)
N$53: 60---K6N_C.1 K16.P(2:P)
N$55 [Power]: D19.A K11.2 Q9.3(C)
N$57: 63---K7N_C.1 K17.P(2:P)
N$60: OK9.1(A) R47.2
N$61: OK1.1(A) R30.2
N$62: LED10.A OK9.2(C)
N$63: OK9.3(EMIT) R46.2
N$64: LED2.A OK1.2(C)
N$65: OK1.3(EMIT) R29.2
N$66: Q11.1(B) R46.1
N$67 [Power]: D23.A K13.2 Q13.3(C)
N$68: OK10.1(A) R50.2
N$69: LED11.A OK10.2(C)
N$70: Q1.1(B) R29.1
N$71: OK10.3(EMIT) R48.2
N$72: Q13.1(B) R48.1
N$73 [Power]: D25.A K14.2 Q14.3(C)
N$74: OK11.1(A) R52.2
N$75: LED12.A OK11.2(C)
N$76: OK11.3(EMIT) R51.2
N$77: Q14.1(B) R51.1
N$78 [Power]: D29.A K16.2 Q16.3(C)
N$79: OK12.1(A) R57.2
N$80: LED13.A OK12.2(C)
N$81: OK12.3(EMIT) R56.2
N$82: Q15.1(B) R56.1
N$83 [Power]: D27.A K15.2 Q15.3(C)
N$84: OK13.1(A) R59.2
N$85: LED14.A OK13.2(C)
N$86: OK13.3(EMIT) R58.2
N$87: Q16.1(B) R58.1
N$88 [Power]: D21.A K12.2 Q11.3(C)
N$89: OK14.1(A) R61.2
N$90: LED15.A OK14.2(C)
N$91: OK14.3(EMIT) R60.2
N$92: Q17.1(B) R60.1
N$93 [Power]: D31.A K17.2 Q17.3(C)
N$94 [Power]: D6.A K3.2 Q2.3(C)
N$95 [Power]: D8.A K4.2 Q3.3(C)
N$96 [Power]: D10.A K5.2 Q4.3(C)
N$97 [Power]: D12.A K6.2 Q5.3(C)
N$98 [Power]: D14.A K7.2 Q6.3(C)
N$121: OK16.1(A) R67.2
N$122: LED16.A OK16.2(C)
N$123: OK16.3(EMIT) R1.2
N$124: Q10.1(B) R1.1
N$125 [Power]: D2.A K18.2 Q10.3(C)
N$128: 67---K8N_NF.1 K18.O(2:O)
N$129: 64---K7N_NF.1 K17.O(2:O)
N$130: 61---K6N_NF.1 K16.O(2:O)
N$131: 58---K5N_NF.1 K15.O(2:O)
N$132: 55---K4N_NF.1 K14.O(2:O)
N$133: 52---K3N_NF.1 K13.O(2:O)
N$134: 49---K2N_NF.1 K12.O(2:O)
N$135: 66---K8N_C.1 K18.P(2:P)
N$136: 46---K1N_NF.1 K11.O(2:O)
N$175: OK2.1(A) R32.2
N$176: LED3.A OK2.2(C)
N$177: OK2.3(EMIT) R31.2
N$178: Q2.1(B) R31.1
N$181: OK3.1(A) R34.2
N$183: OK3.3(EMIT) R33.2
N$184: Q3.1(B) R33.1
N$188: OK4.1(A) R36.2
N$193: LED5.A OK4.2(C)
N$194: OK4.3(EMIT) R35.2
N$195: Q4.1(B) R35.1
N$198: OK5.1(A) R38.2
N$199: LED6.A OK5.2(C)
N$200: OK5.3(EMIT) R37.2
N$201: Q5.1(B) R37.1
N$204: OK6.1(A) R40.2
N$206: OK6.3(EMIT) R39.2
N$207: Q6.1(B) R39.1
N$210: OK7.1(A) R42.2
N$211: LED8.A OK7.2(C)
N$212: OK7.3(EMIT) R41.2
N$213: Q7.1(B) R41.1
N$217: Q12.2(B) R54.1 R55.2
PEDAL1: 28---K1E_C.1 K1.P(2:P)
RE: LED6.C ; also sheet 1
RIGHT_TURN_RELAY: LED14.C ; also sheet 1
RIGHT_TURN_SIGNAL: 59---K6N_NA.1 K16.S(2:S) ; also sheet 1
SINAL_ACELERADOR: Q8.2(B) ; also sheet 1
SLOW_WIPER_RELAY: LED10.C ; also sheet 1
YELLOW_BUTTON: C13.+ Q12.1(C) R53.2 ; also sheet 1
Unconnected: K1.O(2:O) K4.O(2:O) K4.P(2:P) K4.S(2:S) K6.O(2:O) K7.O(2:O) K7.P(2:P) K8.S(2:S) LED16.C OK3.2(C) OK6.2(C)

### Notes on the sheet
- Sindal 28 Manga Cinza
- K1
- Sindal 29 Manga Azul
- Cinza Controlbox | Sindal 24
- K2 | Vermelho
- X3-3 | Sindal 17
- SINDAL 46
- SINAL_ACELERADOR
- Amarelo
- Sindal 16
- K3 | Verde
- Sindal 19
- Amarelo
- Sindal 18
- K4
- Sindal 22  Marrom
- K5
- Sindal 20
- Sindal 21
- Sindal 23 Vermelho
- Control Box
  X3-4
- K6
- Azul/Amarelo
- K7
- K8
- Sindal 26
- Sindal 25
- vermelho | preto
- Sindal 33
- K1
- Sindal 32
- vermelho | preto
- Sindal 35
- K2
- Sindal 32
- Sindal 37
- K3
- Sindal 36
- Sindal 39
- K4 | Sindal 38
- Sindal 41
- K5
- Sindal 40
- Sindal 43
- K6
- Sindal 42
- Sindal 45
- K7
- Sindal 44
- K8

## Sheet 3 of 3
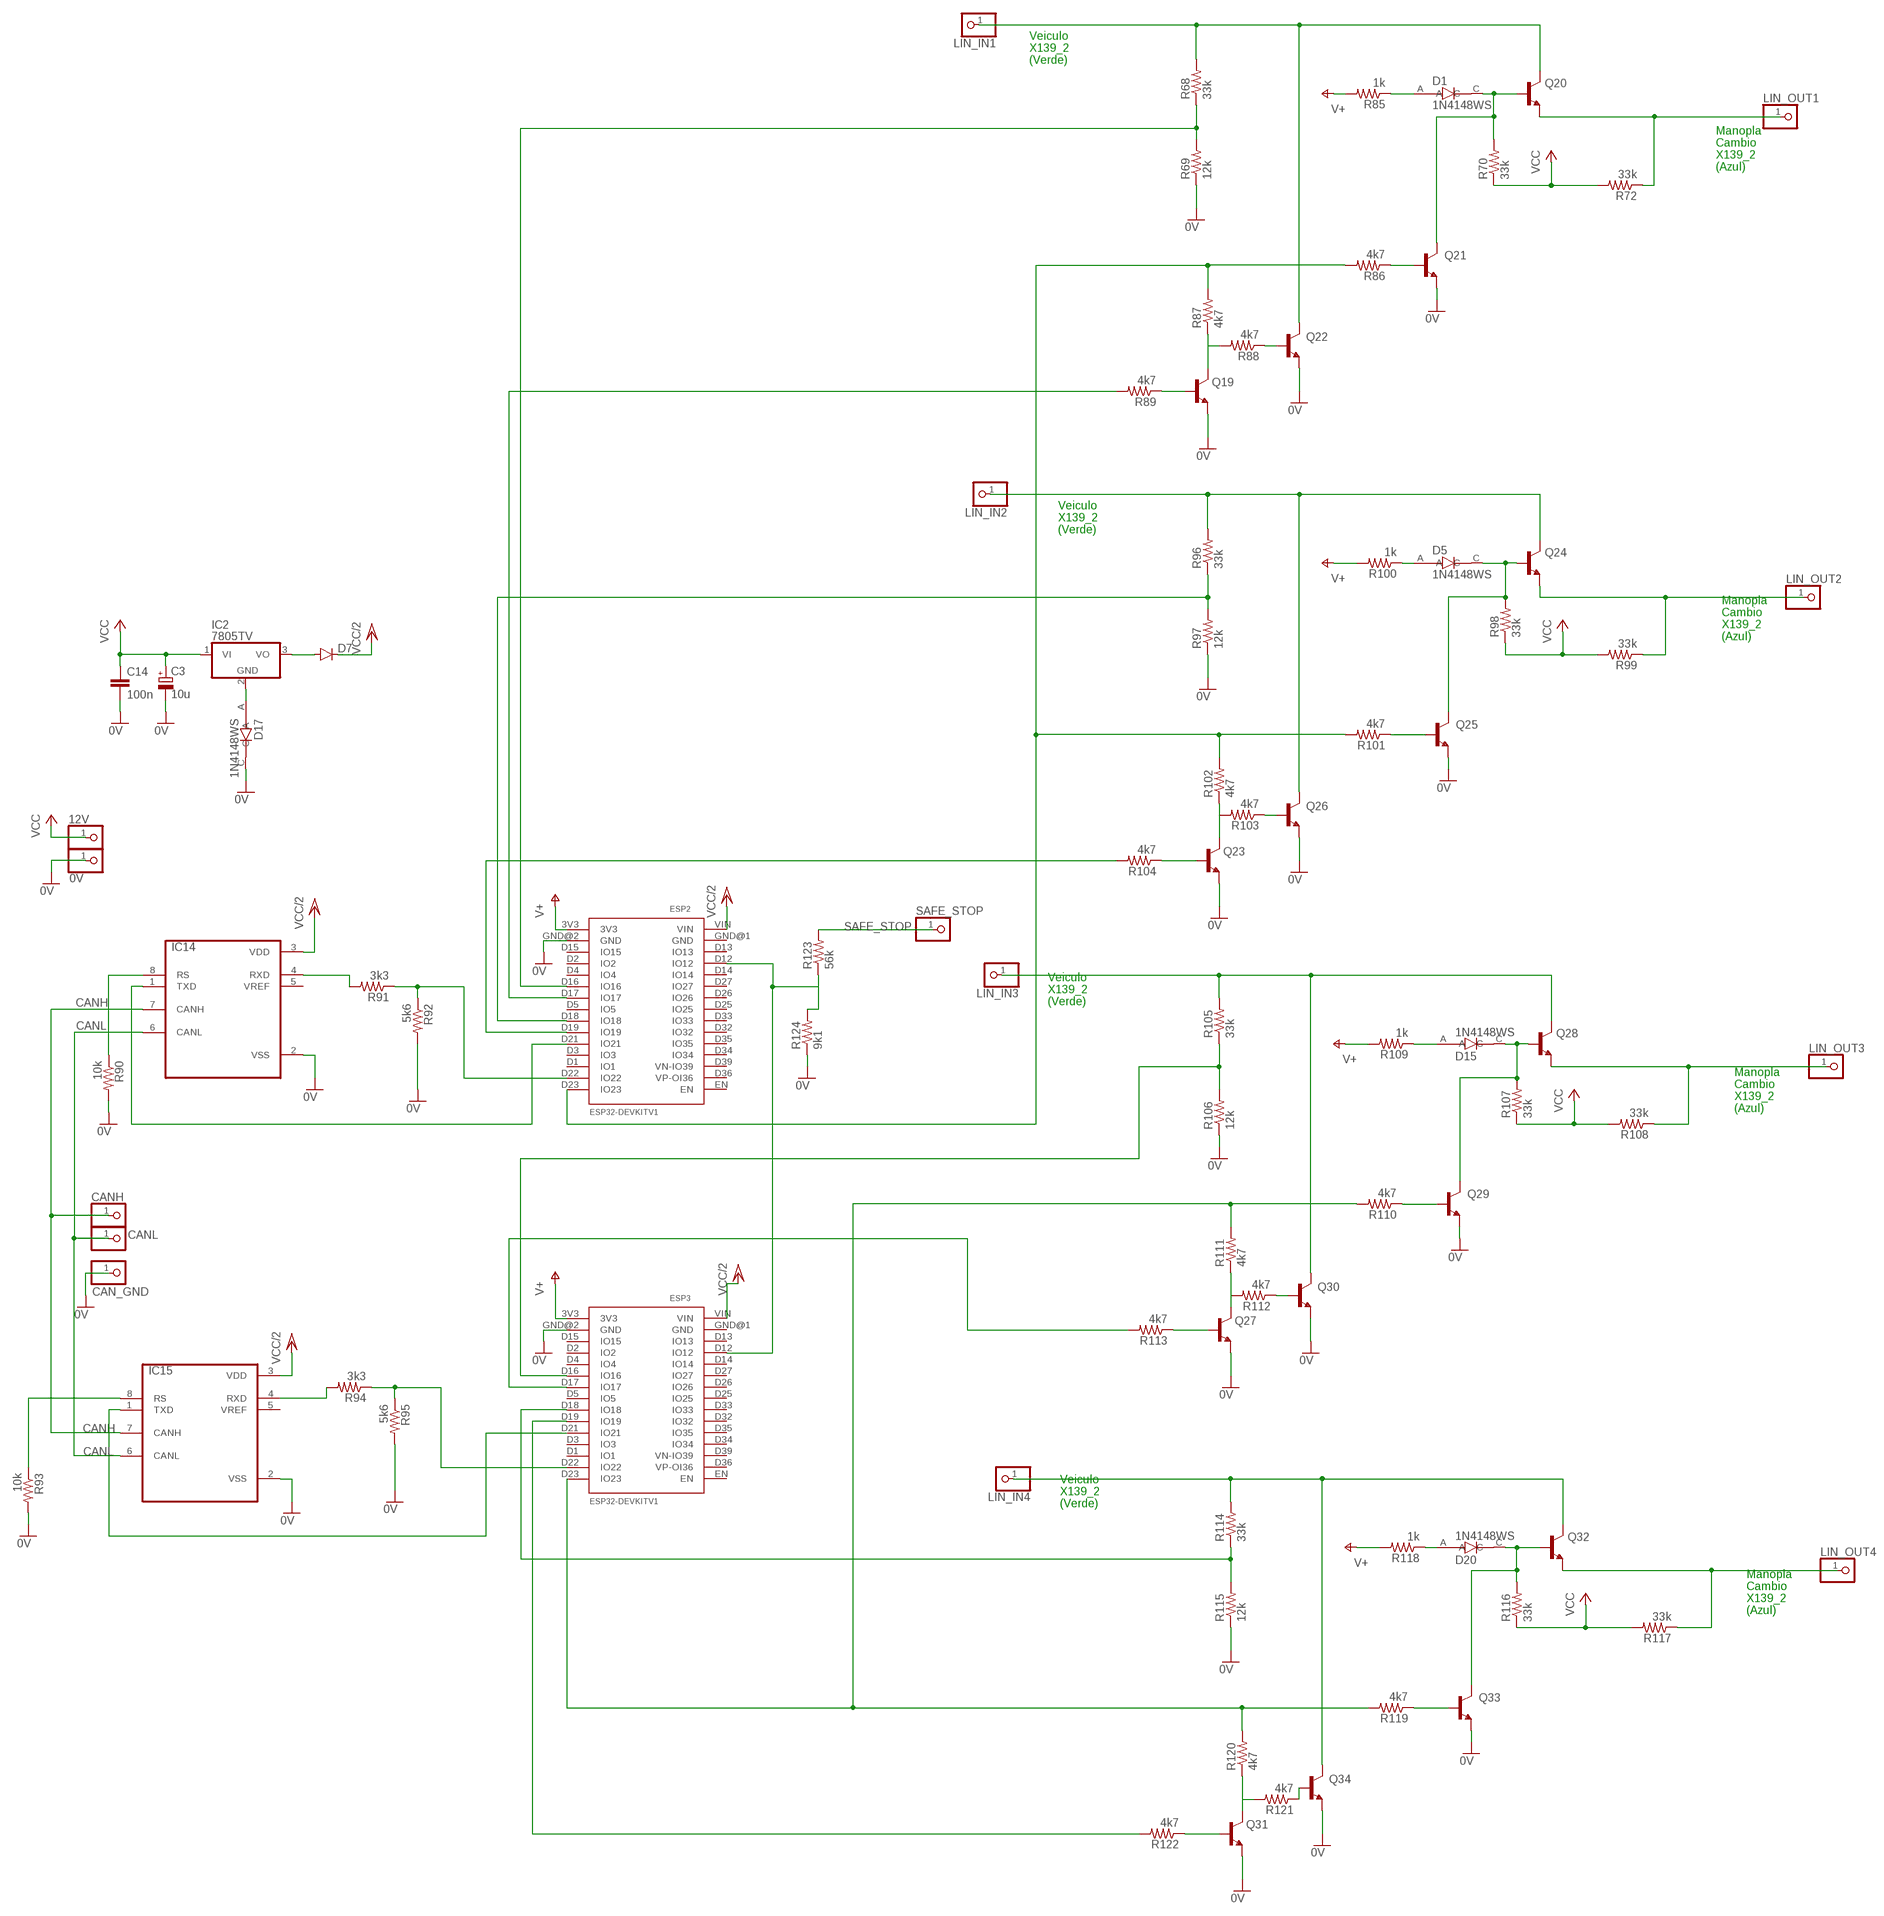
[diagram p4: schematic, sheet 3]

### Parts
0V  PINHD-1X1  [1X01]
12V  PINHD-1X1  [1X01]
C3  10u  CPOL-EUA/3216-18R  [A/3216-18R]
C14  100n  C-EUC0402  [C0402]
CAN_GND  PINHD-1X1  [1X01]
CANH  PINHD-1X1  [1X01]
CANL  PINHD-1X1  [1X01]
D1  1N4148WS  [SODFL2512X100N]
D5  1N4148WS  [SODFL2512X100N]
D7  DIODE-SOD123  [SOD123]
D15  1N4148WS  [SODFL2512X100N]
D17  1N4148WS  [SODFL2512X100N]
D20  1N4148WS  [SODFL2512X100N]
ESP2  ESP32DEVKITV1  [ESP32-DEVKITV1]
ESP3  ESP32DEVKITV1  [ESP32-DEVKITV1]
IC2  7805TV  [TO220V]
IC14  MCP2551-I/SN  [SOIC127P599X175-8N]
IC15  MCP2551-I/SN  [SOIC127P599X175-8N]
LIN_IN1  PINHD-1X1  [1X01]
LIN_IN2  PINHD-1X1  [1X01]
LIN_IN3  PINHD-1X1  [1X01]
LIN_IN4  PINHD-1X1  [1X01]
LIN_OUT1  PINHD-1X1  [1X01]
LIN_OUT2  PINHD-1X1  [1X01]
LIN_OUT3  PINHD-1X1  [1X01]
LIN_OUT4  PINHD-1X1  [1X01]
Q19  -NPN-TO92  [TO92]
Q20  -NPN-TO92  [TO92]
Q21  -NPN-TO92  [TO92]
Q22  -NPN-TO92  [TO92]
Q23  -NPN-TO92  [TO92]
Q24  -NPN-TO92  [TO92]
Q25  -NPN-TO92  [TO92]
Q26  -NPN-TO92  [TO92]
Q27  -NPN-TO92  [TO92]
Q28  -NPN-TO92  [TO92]
Q29  -NPN-TO92  [TO92]
Q30  -NPN-TO92  [TO92]
Q31  -NPN-TO92  [TO92]
Q32  -NPN-TO92  [TO92]
Q33  -NPN-TO92  [TO92]
Q34  -NPN-TO92  [TO92]
R68  33k  R-US_R0402  [R0402]
R69  12k  R-US_R0603  [R0603]
R70  33k  R-US_R0402  [R0402]
R72  33k  R-US_R0402  [R0402]
R85  1k  R-US_R0402  [R0402]
R86  4k7  R-US_R0402  [R0402]
R87  4k7  R-US_R0402  [R0402]
R88  4k7  R-US_R0402  [R0402]
R89  4k7  R-US_R0402  [R0402]
R90  10k  R-US_R0603  [R0603]
R91  3k3  R-US_R0402  [R0402]
R92  5k6  R-US_R0603  [R0603]
R93  10k  R-US_R0603  [R0603]
R94  3k3  R-US_R0402  [R0402]
R95  5k6  R-US_R0603  [R0603]
R96  33k  R-US_R0402  [R0402]
R97  12k  R-US_R0603  [R0603]
R98  33k  R-US_R0402  [R0402]
R99  33k  R-US_R0402  [R0402]
R100  1k  R-US_R0402  [R0402]
R101  4k7  R-US_R0402  [R0402]
R102  4k7  R-US_R0402  [R0402]
R103  4k7  R-US_R0402  [R0402]
R104  4k7  R-US_R0402  [R0402]
R105  33k  R-US_R0402  [R0402]
R106  12k  R-US_R0603  [R0603]
R107  33k  R-US_R0402  [R0402]
R108  33k  R-US_R0402  [R0402]
R109  1k  R-US_R0402  [R0402]
R110  4k7  R-US_R0402  [R0402]
R111  4k7  R-US_R0402  [R0402]
R112  4k7  R-US_R0402  [R0402]
R113  4k7  R-US_R0402  [R0402]
R114  33k  R-US_R0402  [R0402]
R115  12k  R-US_R0603  [R0603]
R116  33k  R-US_R0402  [R0402]
R117  33k  R-US_R0402  [R0402]
R118  1k  R-US_R0402  [R0402]
R119  4k7  R-US_R0402  [R0402]
R120  4k7  R-US_R0402  [R0402]
R121  4k7  R-US_R0402  [R0402]
R122  4k7  R-US_R0402  [R0402]
R123  56k  R-US_R0603  [R0603]
R124  9k1  R-US_R0603  [R0603]
SAFE_STOP  PINHD-1X1  [1X01]

### Nets
0V: 0V.1 C3.- C14.2 CAN_GND.1 D17.C ESP2.GND@2(GND) ESP3.GND@2(GND) IC14.2(VSS) IC15.2(VSS) Q19.1(E) Q21.1(E) Q22.1(E) Q23.1(E) Q25.1(E) Q26.1(E) Q27.1(E) Q29.1(E) Q30.1(E) Q31.1(E) Q33.1(E) Q34.1(E) R69.1 R90.2 R92.2 R93.2 R95.2 R97.1 R106.1 R115.1 R124.1
CANH: CANH.1 IC14.7(CANH) IC15.7(CANH)
CANL: CANL.1 IC14.6(CANL) IC15.6(CANL)
N$16: D1.C Q20.2(B) Q21.3(C) R70.2
N$127: D20.A R118.1
N$137: Q21.2(B) R86.1
N$138: Q19.3(C) R87.1 R88.2
N$139: Q22.2(B) R88.1
N$140: Q19.2(B) R89.1
N$141: D17.A IC2.2(GND)
N$142: D7.A IC2.3(VO)
N$143: IC14.8(RS) R90.1
N$144: IC14.4(RXD) R91.2
N$145: IC15.8(RS) R93.1
N$146: D15.A R109.1
N$147: D5.C Q24.2(B) Q25.3(C) R98.2
N$148: D5.A R100.1
N$149: Q25.2(B) R101.1
N$150: Q23.3(C) R102.1 R103.2
N$151: Q26.2(B) R103.1
N$152: Q23.2(B) R104.1
N$153: D15.C Q28.2(B) Q29.3(C) R107.2
N$154: D1.A R85.1
N$155: Q29.2(B) R110.1
N$156: Q27.3(C) R111.1 R112.2
N$157: Q30.2(B) R112.1
N$158: Q27.2(B) R113.1
N$159: LIN_OUT1.1 Q20.1(E) R72.1
N$160: LIN_OUT3.1 Q28.1(E) R108.1
N$161: D20.C Q32.2(B) Q33.3(C) R116.2
N$162: ESP2.D16(IO16) R68.1 R69.2
N$163: Q33.2(B) R119.1
N$164: Q31.3(C) R120.1 R121.2
N$165: Q34.2(B) R121.1
N$166: Q31.2(B) R122.1
N$167: LIN_OUT2.1 Q24.1(E) R99.1
N$168: ESP2.D12(IO12) ESP3.D12(IO12) R123.1 R124.2
N$169: IC15.4(RXD) R94.2
N$171: ESP2.D17(IO17) R89.2
N$172: ESP2.D18(IO18) R96.1 R97.2
N$173: ESP2.D19(IO19) R104.2
N$174: ESP3.D16(IO16) R105.1 R106.2
N$179: ESP3.D17(IO17) R113.2
N$180: ESP3.D18(IO18) R114.1 R115.2
N$185: ESP3.D19(IO19) R122.2
N$186: LIN_OUT4.1 Q32.1(E) R117.1
N$189: ESP2.D22(IO22) R91.1 R92.1
N$190: ESP2.D23(IO23) R86.2 R87.2 R101.2 R102.2
N$196: ESP3.D23(IO23) R110.2 R111.2 R119.2 R120.2
N$197: ESP2.D21(IO21) IC14.1(TXD)
N$202: ESP3.D22(IO22) R94.1 R95.1
N$203: ESP3.D21(IO21) IC15.1(TXD)
N$208: LIN_IN1.1 Q20.3(C) Q22.3(C) R68.2
N$209: LIN_IN2.1 Q24.3(C) Q26.3(C) R96.2
N$214: LIN_IN3.1 Q28.3(C) Q30.3(C) R105.2
N$215: LIN_IN4.1 Q32.3(C) Q34.3(C) R114.2
SAFE_STOP: R123.2 SAFE_STOP.1
V+: ESP2.3V3 ESP3.3V3 R85.2 R100.2 R109.2 R118.2
VCC: 12V.1 C3.+ C14.1 IC2.1(VI) R70.1 R72.2 R98.1 R99.2 R107.1 R108.2 R116.1 R117.2
VCC/2: D7.C ESP2.VIN ESP3.VIN IC14.3(VDD) IC15.3(VDD)
Unconnected: ESP2.D1(IO1) ESP2.D2(IO2) ESP2.D3(IO3) ESP2.D4(IO4) ESP2.D5(IO5) ESP2.D13(IO13) ESP2.D14(IO14) ESP2.D15(IO15) ESP2.D25(IO25) ESP2.D26(IO26) ESP2.D27(IO27) ESP2.D32(IO32) ESP2.D33(IO33) ESP2.D34(IO34) ESP2.D35(IO35) ESP2.D36(VP-OI36) ESP2.D39(VN-IO39) ESP2.EN ESP2.GND@1(GND) ESP3.D1(IO1) ESP3.D2(IO2) ESP3.D3(IO3) ESP3.D4(IO4) ESP3.D5(IO5) ESP3.D13(IO13) ESP3.D14(IO14) ESP3.D15(IO15) ESP3.D25(IO25) ESP3.D26(IO26) ESP3.D27(IO27) ESP3.D32(IO32) ESP3.D33(IO33) ESP3.D34(IO34) ESP3.D35(IO35) ESP3.D36(VP-OI36) ESP3.D39(VN-IO39) ESP3.EN ESP3.GND@1(GND) IC14.5(VREF) IC15.5(VREF)

### Notes on the sheet
- Veiculo
  X139_2
  (Verde)
- Manopla
  Cambio
  X139_2
  (Azul)
- Veiculo
  X139_2
  (Verde)
- Manopla
  Cambio
  X139_2
  (Azul)
- Veiculo
  X139_2
  (Verde)
- Manopla
  Cambio
  X139_2
  (Azul)
- Veiculo
  X139_2
  (Verde)
- Manopla
  Cambio
  X139_2
  (Azul)

## Power pins joined to a net without a drawn wire
V+: IC12.4(P:V+) IC13.4(P:V+) IC16.4(P:V+) IC17.4(P:V+)
V-: IC12.11(P:V-) IC13.11(P:V-) IC16.11(P:V-) IC17.11(P:V-)

## Library data of the parts
0V 1---12V_SINDAL27 2---GND_POWER1 3---CAN_GND 4---CAN_H 5---CAN_L 6---INPUT_CIRCUITO_VOLANTE 7---OUTPUT_CIRCUITO_VOLANTE 8---VOLANTE_SEN 9---VOLANTE_GND 10---VOLANTE_COS 11---VOLANTE_SIGNAL 12---5V 12V 13---GND_POWER2 14---LEFT_TURN_LIGHT 15---RIGHT_TURN_LIGHT 16---HIGH_BEAM 17---LOW_BEAM 18---HORN 19---SLOW_WINDSHIELD_WIPER 20---FAST_WINDSHIELD_WIPER 21---RIGHT_FRONT_DOOR 22---LEFT_FRONT_DOOR 23---RIGHT_REAR_DOOR 24---LEFT_REAR_DOOR 25---SIGNAL1 26---SIGNAL2 27---K1E_NA 28---K1E_C 29---K2E_C 30---K2E_NF 31---K3E_C 32---K3E_NF 36---K5E_C 37---K5E_NF 38---K6E_C 42---K8E_C 43---K8E_NF 46---K1N_NF 49---K2N_NF 50---K3N_NA 51---K3N_C 52---K3N_NF 53---K4N_NA 54---K4N_C 55---K4N_NF 56---K5N_NA 57---K5N_C 58---K5N_NF 59---K6N_NA 60---K6N_C 61---K6N_NF 62---K7N_NA 63---K7N_C 64---K7N_NF 65---K8N_NA 66---K8N_C 67---K8N_NF 68--- 69--- 70--- CAN_GND CANH CANL LIN_IN1-LIN_IN4 LIN_OUT1-LIN_OUT4 SAFE_STOP = pin_1.5mm:PINHD-1X1: PIN HEADER
C1 C4 C6 C8-C10 C14-C18 C20-C29 = rcl:C-EU: CAPACITOR, European symbol; SPICEPREFIX: C
C2 C3 C5 C7 C13 C19 = rcl:CPOL-EU: POLARIZED CAPACITOR, European symbol; SPICEPREFIX: C
C11 C12 C30 = capacitor-wima:C: CAPACITOR naming: grid - package width
D1 D2 D4-D6 D8 D10 D12 D14-D21 D23 D25 D27 D29 D31 D33 GND = 1N4148WS:1N4148WS: 1N4148WS Series 75 V 300 mA Surface Mount Small Signal Diodes - SOD-323F; MANUFACTURER: Fairchild Semiconductor
D3 D7 = diode:DIODE-: DIODE
D9 D11 = diode:1N4148: DIODE high speed (Philips)
D13 D22 = display-hp:HLMP6: LED 2mm horizontal; MF: AGILENT TECHNOLOGIES; MPN: HLMP-6500; OC_FARNELL: 1652490; OC_NEWARK: 40K0088
ESP1-ESP3 = ESP32-DEVKITV1:ESP32DEVKITV1
F1 = fuse:GSH15: FUSE HOLDER grid 15mm, 19649 Wickmann; MPN: 64900001039; OC_FARNELL: 1271673; OC_NEWARK: 02P0318
IC1(MCP2551) IC14 IC15 = MCP2551-I_SN:MCP2551-I/SN: Check availability <https://pricing.snapeda.com/parts/MCP2551-I/SN/Microchip/view-part?ref=eda>; AVAILABILITY: In Stock; DESCRIPTION: 1/1 Transceiver Half CANbus 8-SOIC; MF: Microchip; MP: MCP2551-I/SN; PACKAGE: SOIC-8 Microchip; PRICE: None; PURCHASE-URL: https://pricing.snapeda.com/search/part/MCP2551-I/SN/?ref=eda
IC2 IC7 = linear:78*: Positive VOLTAGE REGULATOR Source: http://cache.national.com/ds/LM/LM78L05.pdf http://www.fairchildsemi.com/ds/LM/LM7805.pdf
IC3 IC4 = 74xx-eu:74*166: 8-bit parallel load SHIFT REGISTER
IC5 = 74xx-eu:74*595: 8-bit SHIFT REGISTER, output latch
IC6 = LM6142BIN:LM6142BIN: OP Amps Source: Datasheet; ARROW_PART_NUMBER: LM6142BIN; DESCRIPTION: OP Amps; HEIGHT: mm; MANUFACTURER_NAME: Texas Instruments; MANUFACTURER_PART_NUMBER: LM6142BIN; MOUSER_PART_NUMBER: 926-LM6142BIN; MOUSER_PRICE-STOCK: https://www.mouser.com/Search/Refine.aspx?Keyword=926-LM6142BIN
IC8 IC12 IC13 IC16 IC17 = linear:LM324: OP AMP
IC9 = 40xx:4016: Quad bilateral ANALOG SWITCH
IC10 = 74xx-eu:74*08: Quad 2-input AND gate
IC11 = 74xx-eu:74*04: Hex INVERTER
JP1 = pinhead:PINHD-1X8: PIN HEADER
K1-K8 K11-K18 = relay:G5LE: RELAY 1 x switch, 10 A/120 V AC, 8 A/30 V DC, Omron; OC_FARNELL: unknown; OC_NEWARK: unknown
LED1-LED3 LED5 LED6 LED8-LED16 = led:LED: LED OSRAM: - CHIPLED LG R971, LG N971, LY N971, LG Q971, LY Q971, LO R971, LY R971 LH N974, LH R974 LS Q976, LO Q976, LY Q976 LO Q996 - Hyper CHIPLED LW Q18S LB Q993, LB Q99A, LB R99A - SideLED LS A670, LO A670, LY A670, LG A670, LP A670 LB A673, LV A673, LT A673, LW A673 LH A674 LY A675 LS A676, LA A676, LO A676, LY A676, LW A676 LS A679, LY A679, LG A679 - Hyper Micro SIDELED® LS Y876, LA Y876, LO Y876, LY Y876 LT Y87S - SmartLED LW L88C, LW L88S LB L89C, LB L89S, LG L890 LS L89K, LO L89K, LY L89K LS L896, LA L896, LO L896, LY L896 - TOPLED LS T670, LO T670, LY T670, LG T670, LP T670 LSG T670, LSP T670, LSY T670, LOP T670, LYG T670 LG T671, LOG T671, LSG T671 LB T673, LV T673, LT T673, LW T673 LH T674 LS T676, LA T676, LO T676, LY T676, LB T676, LH T676, LSB T676, LW T676 LB T67C, LV T67C, LT T67C, LS T67K, LO T67K, LY T67K, LW E67C LS E67B, LA E67B, LO E67B, LY E67B, LB E67C, LV E67C, LT E67C LW T67C LS T679, LY T679, LG T679 LS T770, LO T770, LY T770, LG T770, LP T770 LB T773, LV T773, LT T773, LW T773 LH T774 LS E675, LA E675, LY E675, LS T675 LS T776, LA T776, LO T776, LY T776, LB T776 LHGB T686 LT T68C, LB T68C - Hyper Mini TOPLED® LB M676 - Mini TOPLED Santana® LG M470 LS M47K, LO M47K, LY M47K Source: http://www.osram.convergy.de LUXEON: - LUMILED® LXK2-PW12-R00, LXK2-PW12-S00, LXK2-PW14-U00, LXK2-PW14-V00 LXK2-PM12-R00, LXK2-PM12-S00, LXK2-PM14-U00 LXK2-PE12-Q00, LXK2-PE12-R00, LXK2-PE12-S00, LXK2-PE14-T00, LXK2-PE14-U00 LXK2-PB12-K00, LXK2-PB12-L00, LXK2-PB12-M00, LXK2-PB14-N00, LXK2-PB14-P00, LXK2-PB14-Q00 LXK2-PR12-L00, LXK2-PR12-M00, LXK2-PR14-Q00, LXK2-PR14-R00 LXK2-PD12-Q00, LXK2-PD12-R00, LXK2-PD12-S00 LXK2-PH12-R00, LXK2-PH12-S00 LXK2-PL12-P00, LXK2-PL12-Q00, LXK2-PL12-R00 Source: www.luxeon.com KINGBRIGHT: KA-3528ASYC Source: www.kingbright.com
OK1-OK16 = optocoupler:LTV816: OPTO COUPLER Source: LITEON, LTV816.pdf
POTENCIOMETRO = con-lstb:MA03-1: PIN HEADER; OC_FARNELL: unknown; OC_NEWARK: unknown
Q1-Q7 Q9-Q11 Q13-Q18 = semicon-smd-ipc:NPN-TRANSISTOR_: NPN TRANSISTOR
Q8 Q12 = my_components:S9013: NPN Transistor
Q19-Q34 = transistor-neu-to92:*-NPN-: NPN Transistror
Q35 = BC558:BC558: Bipolar (BJT) Transistor PNP 30V 100mA 150MHz 500mW Through Hole TO-92-3 Check availability <https://pricing.snapeda.com/parts/BC558/ON/view-part?ref=eda>; AVAILABILITY: In Stock; DESCRIPTION: Bipolar (BJT) Transistor PNP 30 V 100 mA 360MHz 625 mW Through Hole TO-92 (TO-226); MF: ON; MP: BC558; PACKAGE: TO-226-3 Diotec Semiconductor; PRICE: None; PURCHASE-URL: https://pricing.snapeda.com/search?q=BC558&ref=eda
R1-R6 R8-R44 R46-R48 R50-R63 R66-R124 R134-R137 = rcl:R-US_: RESISTOR, American symbol; SPICEPREFIX: R
R7 = pot:TRIM_US-: POTENTIOMETER
R125-R133 = Resistor:R-US: Resistor Fixed - ANSI; CATEGORY: Resistor; SUB-CATEGORY: Fixed
SV1-SV12 = con-lstb:MA20-2: PIN HEADER; OC_FARNELL: unknown; OC_NEWARK: unknown
SV13-SV15 = con-lstb:MA10-2: PIN HEADER; OC_FARNELL: unknown; OC_NEWARK: unknown
T3 = TIP31C:TIP31C: NPN TRANSISTOR Check availability <https://pricing.snapeda.com/parts/TIP31C/onsemi/view-part?ref=eda>; AVAILABILITY: In Stock; DESCRIPTION: Bipolar (BJT) Transistor NPN 100 V 3 A 3MHz 40 W Through Hole TO-220; MF: onsemi; MP: TIP31C; PACKAGE: TO-220-3 ON; PRICE: None; PURCHASE-URL: https://pricing.snapeda.com/search?q=TIP31C&ref=eda
U1 = 74HC14N_652:74HC14N,652: Hex inverting Schmitt trigger Check availability <https://pricing.snapeda.com/parts/74HC14N%2C652/NXP%20USA/view-part?ref=eda>; AVAILABILITY: In Stock; CHECK_PRICES: https://www.snapeda.com/parts/74HC14N,652/NXP+USA+Inc./view-part/?ref=eda; DESCRIPTION: Inverter IC 6 Channel Schmitt Trigger 14-DIP; MF: NXP USA; MP: 74HC14N,652; PACKAGE: DIP-14 Nexperia; PRICE: None; PURCHASE-URL: https://www.snapeda.com/api/url_track_click_mouser/?unipart_id=2774194&manufacturer=NXP USA&part_name=74HC14N,652&search_term=74hc14; SNAPEDA_LINK: https://www.snapeda.com/parts/74HC14N,652/NXP+USA+Inc./view-part/?ref=snap

## Net classes
1 Power: width 0.838 mm, clearance 0.152 mm